# EAGLE design Adafruit 7in HDMI Backpack (EAGLE 6.6.0)
COMPANY: ADAFRUIT INDUSTRIES; DRAWN: FZHAO; REV: A
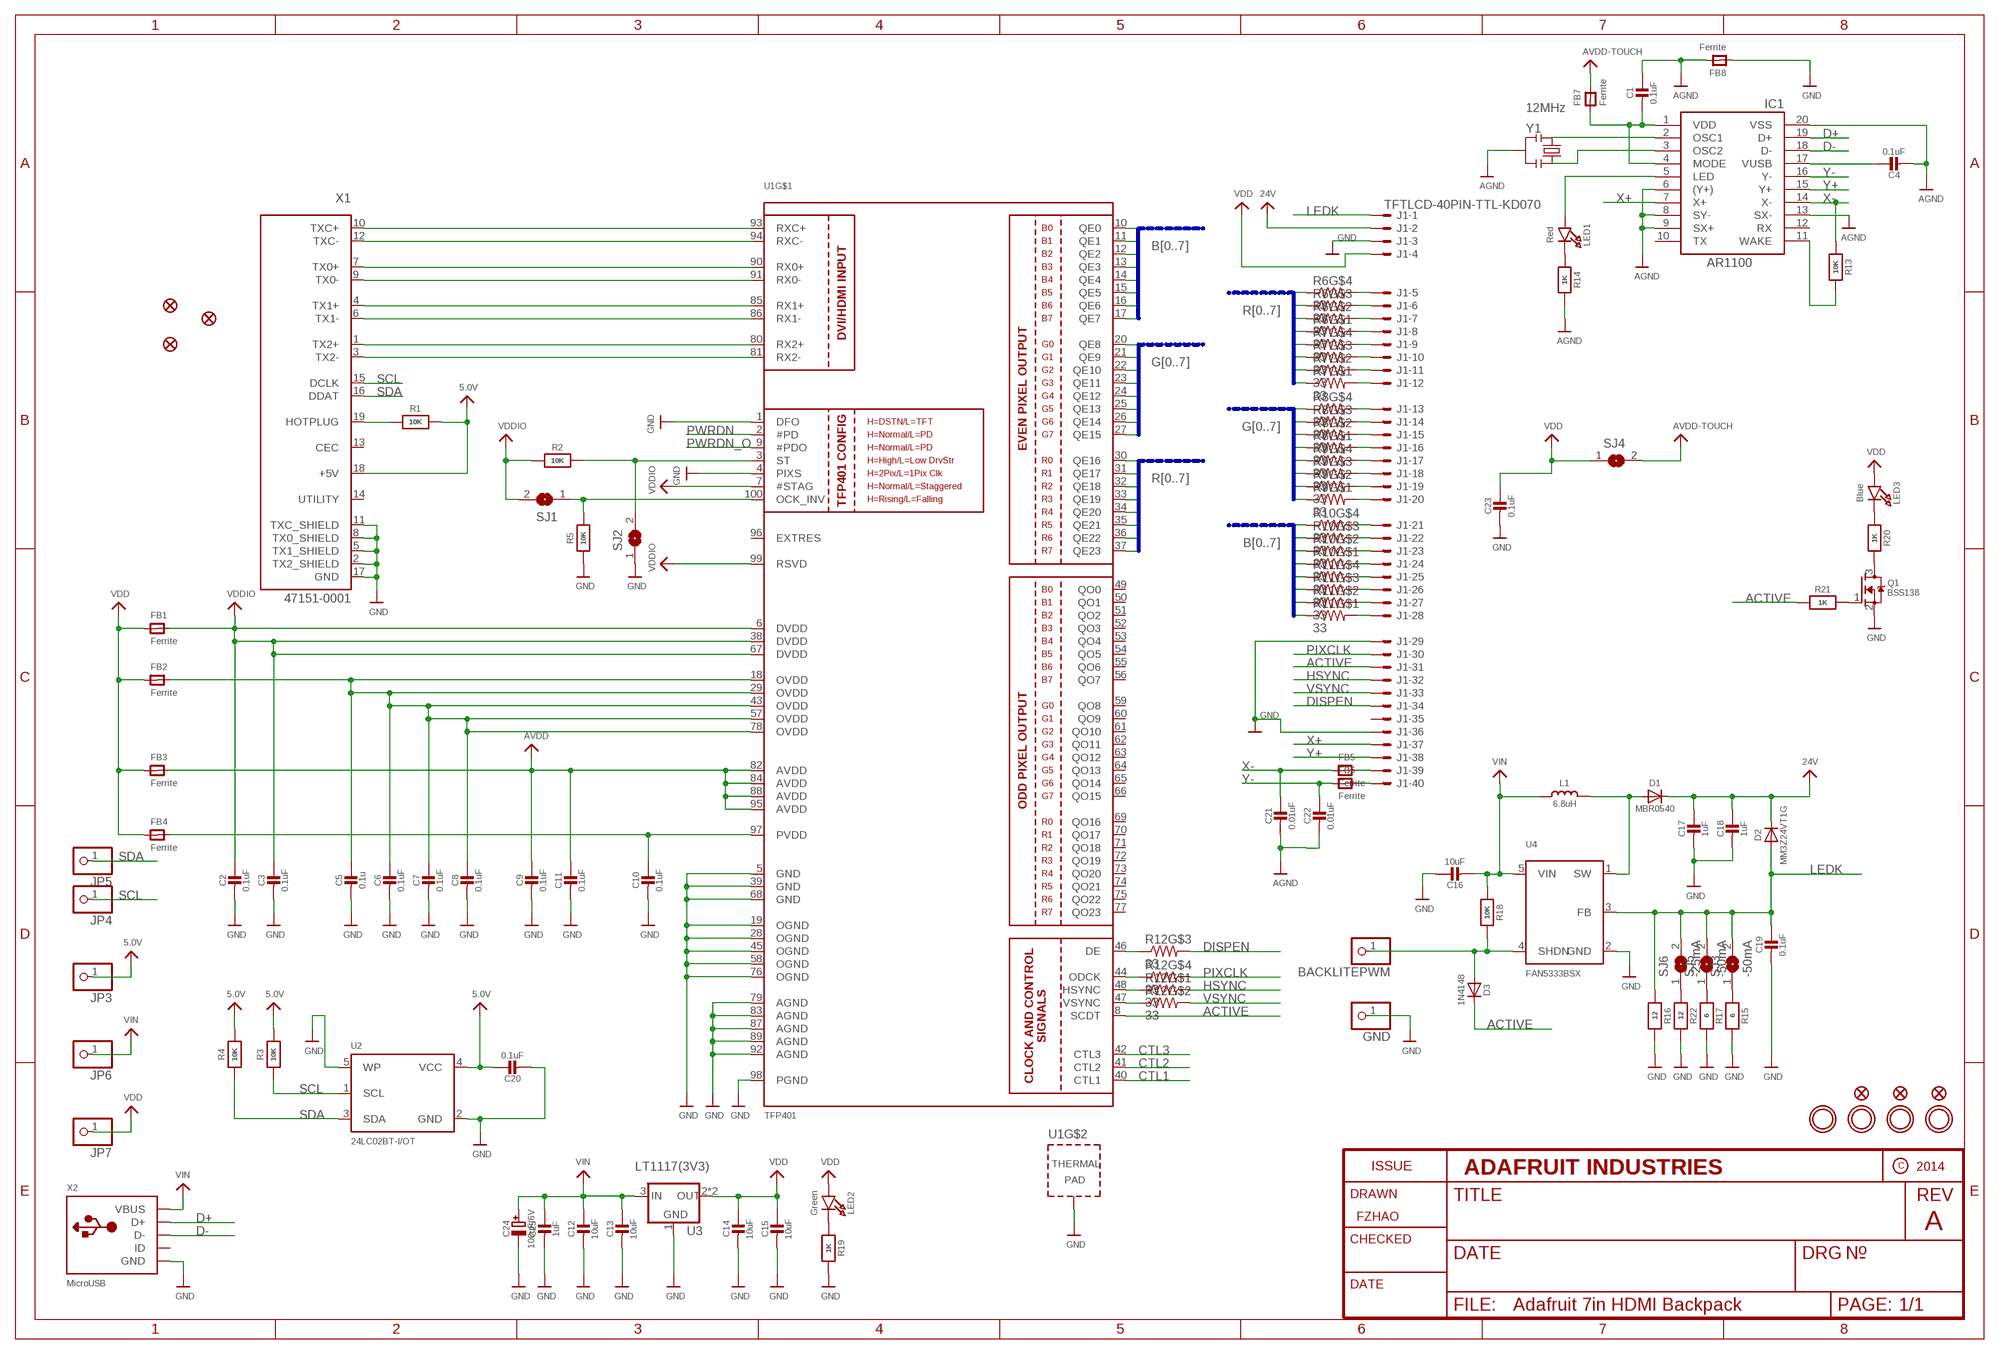
[diagram p0: schematic, sheet 1]

## Parts
BACKLITEPWM  HEADER-1X1-SMD_MASKHELD_2X2MM  [1X01_SMD_MASKHELD_2X2MM]
C1  0.1uF  CAP_CERAMIC0805-NOOUTLINE  [0805-NO]
C2  0.1uF  CAP_CERAMIC0805-NOOUTLINE  [0805-NO]
C3  0.1uF  CAP_CERAMIC0805-NOOUTLINE  [0805-NO]
C4  0.1uF  CAP_CERAMIC_0805MP  [_0805MP]
C5  0.1u  CAP_CERAMIC0805-NOOUTLINE  [0805-NO]
C6  0.1uF  CAP_CERAMIC_0805MP  [_0805MP]
C7  0.1uF  CAP_CERAMIC0805-NOOUTLINE  [0805-NO]
C8  0.1uF  CAP_CERAMIC0805-NOOUTLINE  [0805-NO]
C9  0.1uF  CAP_CERAMIC0805-NOOUTLINE  [0805-NO]
C10  0.1uF  CAP_CERAMIC0805-NOOUTLINE  [0805-NO]
C11  0.1uF  CAP_CERAMIC0805-NOOUTLINE  [0805-NO]
C12  10uF  CAP_CERAMIC0805-NOOUTLINE  [0805-NO]
C13  10uF  CAP_CERAMIC0805-NOOUTLINE  [0805-NO]
C14  10uF  CAP_CERAMIC0805-NOOUTLINE  [0805-NO]
C15  10uF  CAP_CERAMIC0805-NOOUTLINE  [0805-NO]
C16  10uF  CAP_CERAMIC0805-NOOUTLINE  [0805-NO]
C17  1uF  CAP_CERAMIC0805-NOOUTLINE  [0805-NO]
C18  1uF  CAP_CERAMIC0805-NOOUTLINE  [0805-NO]
C19  0.1uF  CAP_CERAMIC0805-NOOUTLINE  [0805-NO]
C20  0.1uF  CAP_CERAMIC0805-NOOUTLINE  [0805-NO]
C21  0.01uF  CAP_CERAMIC0805-NOOUTLINE  [0805-NO]
C22  0.01uF  CAP_CERAMIC0805-NOOUTLINE  [0805-NO]
C23  0.1uF  CAP_CERAMIC0805-NOOUTLINE  [0805-NO]
C24  100uF/6V  CAP_ELECTROLYTICPANASONIC_C  [PANASONIC_C]
C25  1uF  CAP_CERAMIC0805-NOOUTLINE  [0805-NO]
D1  MBR0540  DIODESOD-123  [SOD-123]
D2  MM3Z24VT1G  DIODESMA  [SMADIODE]
D3  1N4148  DIODESOD-323  [SOD-323]
FB1  Ferrite  FERRITE_0805MP  [_0805MP]
FB2  Ferrite  FERRITE_0805MP  [_0805MP]
FB3  Ferrite  FERRITE_0805MP  [_0805MP]
FB4  Ferrite  FERRITE_0805MP  [_0805MP]
FB5  Ferrite  FERRITE_0805MP  [_0805MP]
FB6  Ferrite  FERRITE_0805MP  [_0805MP]
FB7  Ferrite  FERRITE_0805MP  [_0805MP]
FB8  Ferrite  FERRITE_0805MP  [_0805MP]
FID1  FIDUCIAL""  [FIDUCIAL_1MM]
FID2  FIDUCIAL""  [FIDUCIAL_1MM]
FID3  FIDUCIAL""  [FIDUCIAL_1MM]
FID4  FIDUCIAL""  [FIDUCIAL_1MM]
FID5  FIDUCIAL""  [FIDUCIAL_1MM]
FID6  FIDUCIAL""  [FIDUCIAL_1MM]
GND  HEADER-1X1-SMD_MASKHELD_2X2MM  [1X01_SMD_MASKHELD_2X2MM]
IC1  AR1100  AR1100_SSOP  [TSSOP20-5.3MMBODY]
J1  TFTLCD-40PIN-TTL-KD070  [TFTLCD-KD070GD21-40NT]
JP3  HEADER-1X1-SMD_MASKHELD_2X2MM  [1X01_SMD_MASKHELD_2X2MM]
JP4  HEADER-1X1-SMD_MASKHELD_2X2MM  [1X01_SMD_MASKHELD_2X2MM]
JP5  HEADER-1X1-SMD_MASKHELD_2X2MM  [1X01_SMD_MASKHELD_2X2MM]
JP6  HEADER-1X1-SMD_MASKHELD_2X2MM  [1X01_SMD_MASKHELD_2X2MM]
JP7  HEADER-1X1-SMD_MASKHELD_2X2MM  [1X01_SMD_MASKHELD_2X2MM]
L1  6.8uH  INDUCTORNR5040  [INDUCTOR_5X5MM_NR5040_NOTHERMALS]
LED1  Red  LED0805_NOOUTLINE  [CHIPLED_0805_NOOUTLINE]
LED2  Green  LED0805_NOOUTLINE  [CHIPLED_0805_NOOUTLINE]
LED3  Blue  LED0805_NOOUTLINE  [CHIPLED_0805_NOOUTLINE]
Q1  BSS138  MOSFET-NWIDE  [SOT23-WIDE]
R1  10K  RESISTOR0805_NOOUTLINE  [0805-NO]
R2  10K  RESISTOR_0805MP  [_0805MP]
R3  10K  RESISTOR0805_NOOUTLINE  [0805-NO]
R4  10K  RESISTOR0805_NOOUTLINE  [0805-NO]
R5  10K  RESISTOR_0805MP  [_0805MP]
R6  33  RESISTOR_4PACK_US  [RESPACK_4X0603]
R7  33  RESISTOR_4PACK_US  [RESPACK_4X0603]
R8  33  RESISTOR_4PACK_US  [RESPACK_4X0603]
R9  33  RESISTOR_4PACK_US  [RESPACK_4X0603]
R10  33  RESISTOR_4PACK_US  [RESPACK_4X0603]
R11  33  RESISTOR_4PACK_US  [RESPACK_4X0603]
R12  33  RESISTOR_4PACK_US  [RESPACK_4X0603]
R13  10K  RESISTOR0805_NOOUTLINE  [0805-NO]
R14  1K  RESISTOR0805_NOOUTLINE  [0805-NO]
R15  6  RESISTOR0805_NOOUTLINE  [0805-NO]
R16  12  RESISTOR0805_NOOUTLINE  [0805-NO]
R17  6  RESISTOR0805_NOOUTLINE  [0805-NO]
R18  10K  RESISTOR0805_NOOUTLINE  [0805-NO]
R19  1K  RESISTOR0805_NOOUTLINE  [0805-NO]
R20  1K  RESISTOR0805_NOOUTLINE  [0805-NO]
R21  1K  RESISTOR0805_NOOUTLINE  [0805-NO]
R22  12  RESISTOR0805_NOOUTLINE  [0805-NO]
SJ1  SOLDERJUMPER  [SOLDERJUMPER_ARROW_NOPASTE]
SJ2  SOLDERJUMPER  [SOLDERJUMPER_ARROW_NOPASTE]
SJ3  -50mA  SOLDERJUMPERCLOSED  [SOLDERJUMPER_CLOSEDWIRE]
SJ4  SOLDERJUMPERCLOSED  [SOLDERJUMPER_CLOSEDWIRE]
SJ5  -50mA  SOLDERJUMPERCLOSED  [SOLDERJUMPER_CLOSEDWIRE]
SJ6  -25mA  SOLDERJUMPERCLOSED  [SOLDERJUMPER_CLOSEDWIRE]
U1  TFP401  [S-PQFP-G100]
U2  24LC02BT-I/OT  EEPROM_I2C_MCP24AA32  [SOT23-5]
U3  LT1117(3V3)  VREG_SOT223  [SOT223-R]
U4  FAN5333BSX  VREG_FAN5331  [SOT23-5]
U$31  MOUNTINGHOLE3.0  [MOUNTINGHOLE_3.0_PLATED]
U$32  MOUNTINGHOLE3.0  [MOUNTINGHOLE_3.0_PLATED]
U$33  MOUNTINGHOLE3.0  [MOUNTINGHOLE_3.0_PLATED]
U$34  MOUNTINGHOLE3.0  [MOUNTINGHOLE_3.0_PLATED]
X1  47151-0001  HDMI_MOLEX_47151DIM  [HDMI_MOLEX_47151-0001_DIMLAYER]
X2  MicroUSB  USBMICRO_20329  [4UCONN_20329]
Y1  12MHz  RESONATORSMD  [RESONATOR-SMD]

## Nets
5.0V: C20.1 JP3.1 R1.2 R3.2 R4.2 U2.4(VCC) X1.18(+5V)
24V: C17.1 C18.1 D1.C D2.C J1.2
ACTIVE: D3.C J1.31 R21.1 U1.8(SCDT)
AGND: C1.1 C4.2 C21.2 C22.2 FB8.2 IC1.6((Y+)) IC1.8(SY-) IC1.9(SX+) IC1.13(SX-) IC1.20(VSS) R14.2 Y1.2
ASD: R12.3 U1.46(DE)
AVDD: C9.1 C11.1 FB3.2 U1.82(AVDD) U1.84(AVDD) U1.88(AVDD) U1.95(AVDD)
AVDD2: FB7.2 SJ4.2 ; supply symbol labelled AVDD-TOUCH
B0: R10.4 U1.10(QE0)
B1: R10.3 U1.11(QE1)
B2: R10.2 U1.12(QE2)
B3: R10.1 U1.13(QE3)
B4: R11.4 U1.14(QE4)
B5: R11.3 U1.15(QE5)
B6: R11.2 U1.16(QE6)
B7: R11.1 U1.17(QE7)
CTL1: U1.40(CTL1)
CTL2: U1.41(CTL2)
CTL3: U1.42(CTL3)
CVB: R12.2 U1.47(VSYNC)
D+: IC1.19(D+) X2.D+
D-: IC1.18(D-) X2.D-
DISPEN: J1.34 R12.6
G0: R8.4 U1.20(QE8)
G1: R8.3 U1.21(QE9)
G2: R8.2 U1.22(QE10)
G3: R8.1 U1.23(QE11)
G4: R9.4 U1.24(QE12)
G5: R9.3 U1.25(QE13)
G6: R9.2 U1.26(QE14)
G7: R9.1 U1.27(QE15)
GND: C2.2 C3.2 C5.2 C6.2 C7.2 C8.2 C9.2 C10.2 C11.2 C12.2 C13.2 C14.2 C15.2 C16.1 C17.2 C18.2 C19.2 C20.2 C23.2 C24.- C25.2 FB8.1 GND.1 J1.3 J1.29 J1.36 Q1.2(S) R5.1 R15.2 R16.2 R17.2 R19.2 R22.2 SJ2.1 U1.1(DFO) U1.4(PIXS) U1.5(GND) U1.19(OGND) U1.28(OGND) U1.39(GND) U1.45(OGND) U1.58(OGND) U1.68(GND) U1.76(OGND) U1.79(AGND) U1.83(AGND) U1.87(AGND) U1.89(AGND) U1.92(AGND) U1.98(PGND) U1.P$1(TP) U1.P$2(TP) U1.P$3(TP) U1.P$4(TP) U1.P$5(TP) U1.P$6(TP) U1.P$7(TP) U1.P$8(TP) U1.P$9(TP) U1.P$10(TP) U1.P$11(TP) U1.P$12(TP) U1.P$13(TP) U1.P$14(TP) U1.P$15(TP) U1.P$16(TP) U1.THERMAL(TP) U2.2(GND) U2.5(WP) U3.1(GND) U4.2(GND) X1.2(TX2_SHIELD) X1.5(TX1_SHIELD) X1.8(TX0_SHIELD) X1.11(TXC_SHIELD) X1.17(GND) X2.BASE@1(GND) X2.BASE@2(GND) X2.GND X2.SPRT@1(GND) X2.SPRT@2(GND) X2.SPRT@3(GND) X2.SPRT@4(GND)
HSYNC: J1.32 R12.8
LEDK: C19.1 D2.A J1.1 R16.1 SJ3.2 SJ5.2 SJ6.2 U4.3(FB)
N$1: U1.93(RXC+) X1.10(TXC+)
N$2: U1.94(RXC-) X1.12(TXC-)
N$3: U1.90(RX0+) X1.7(TX0+)
N$4: U1.91(RX0-) X1.9(TX0-)
N$5: U1.85(RX1+) X1.4(TX1+)
N$6: U1.86(RX1-) X1.6(TX1-)
N$7: U1.80(RX2+) X1.1(TX2+)
N$8: U1.81(RX2-) X1.3(TX2-)
N$9: R1.1 X1.19(HOTPLUG)
N$10: IC1.2(OSC1) Y1.1
N$11: IC1.3(OSC2) Y1.3
N$12: C4.1 IC1.17(VUSB)
N$13: LED2.C R19.1
N$14: J1.5 R6.5
N$15: J1.6 R6.6
N$16: J1.7 R6.7
N$17: J1.8 R6.8
N$18: J1.9 R7.5
N$19: J1.10 R7.6
N$20: J1.11 R7.7
N$21: J1.12 R7.8
N$22: J1.13 R8.5
N$23: J1.14 R8.6
N$24: J1.15 R8.7
N$25: J1.16 R8.8
N$26: J1.17 R9.5
N$27: J1.18 R9.6
N$28: J1.19 R9.7
N$29: J1.20 R9.8
N$30: J1.21 R10.5
N$31: J1.22 R10.6
N$32: J1.23 R10.7
N$33: J1.24 R10.8
N$34: J1.25 R11.5
N$35: J1.26 R11.6
N$36: J1.27 R11.7
N$37: R17.1 SJ5.1
N$38: C10.1 FB4.2 U1.97(PVDD)
N$39: J1.28 R11.8
N$40: IC1.11(WAKE) R13.2
N$41: LED1.C R14.1
N$42: C5.1 C6.1 C7.1 C8.1 FB2.2 U1.18(OVDD) U1.29(OVDD) U1.43(OVDD) U1.57(OVDD) U1.78(OVDD)
N$43: IC1.5(LED) LED1.A
N$44: R22.1 SJ6.1
N$45: LED3.C R20.1
N$46: Q1.3(D) R20.2
N$47: D1.A L1.P$2 U4.1(SW)
N$48: Q1.1(G) R21.2
N$49: R15.1 SJ3.1
N$52: BACKLITEPWM.1 D3.A R18.2 U4.4(SHDN)
N$53: FB5.2 J1.39
N$54: FB6.2 J1.40
N$55: C1.2 FB7.1 IC1.1(VDD) IC1.4(MODE)
OCK_INV: R5.2 SJ1.1 U1.100(OCK_INV)
PIXCLK: J1.30 R12.5
PWRDN: U1.2(#PD)
PWRDN_O: U1.9(#PDO)
R0: R6.4 U1.30(QE16)
R1: R6.3 U1.31(QE17)
R2: R6.2 U1.32(QE18)
R3: R6.1 U1.33(QE19)
R4: R7.4 U1.34(QE20)
R5: R7.3 U1.35(QE21)
R6: R7.2 U1.36(QE22)
R7: R7.1 U1.37(QE23)
SCL: JP4.1 R3.1 U2.1(SCL) X1.15(DCLK)
SDA: JP5.1 R4.1 U2.3(SDA) X1.16(DDAT)
ST: R2.2 SJ2.2 U1.3(ST)
VDD: C14.1 C15.1 C23.1 FB1.1 FB2.1 FB3.1 FB4.1 J1.4 JP7.1 LED2.A LED3.A SJ4.1 U3.2(OUT) U3.4(OUT)
VDDIO: C2.1 C3.1 FB1.2 R2.1 SJ1.2 U1.6(DVDD) U1.7(#STAG) U1.38(DVDD) U1.67(DVDD) U1.99(RSVD)
VIN: C12.1 C13.1 C16.2 C24.+ C25.1 JP6.1 L1.P$1 R18.1 U3.3(IN) U4.5(VIN) X2.VBUS
VSYNC: J1.33 R12.7
X+: IC1.7(X+) J1.37
X-: C21.1 FB5.1 IC1.14(X-) R13.1
XCV: R12.1 U1.48(HSYNC)
Y+: IC1.15(Y+) J1.38
Y-: C22.1 FB6.1 IC1.16(Y-)
ZXC: R12.4 U1.44(ODCK)
Unconnected: IC1.10(TX) IC1.12(RX) J1.35 U1.49(QO0) U1.50(QO1) U1.51(QO2) U1.52(QO3) U1.53(QO4) U1.54(QO5) U1.55(QO6) U1.56(QO7) U1.59(QO8) U1.60(QO9) U1.61(QO10) U1.62(QO11) U1.63(QO12) U1.64(QO13) U1.65(QO14) U1.66(QO15) U1.69(QO16) U1.70(QO17) U1.71(QO18) U1.72(QO19) U1.73(QO20) U1.74(QO21) U1.75(QO22) U1.77(QO23) U1.96(EXTRES) X1.13(CEC) X1.14(UTILITY) X2.ID

## Buses
B[0..7]
G[0..7]
R[0..7]

## Power pins joined to a net without a drawn wire
GND: X1.P$1(GND) X1.P$2(GND) X1.P$3(GND) X1.P$4(GND)

## Library data of the parts
BACKLITEPWM GND JP3-JP7 = microbuilder:HEADER-1X1: PIN HEADER
C1-C23 C25 = microbuilder:CAP_CERAMIC: Ceramic Capacitors For new designs, use the packages preceded by an '_' character since they are more reliable: The following footprints should be used on most boards: _0402 - Standard footprint for regular board layouts _0603 - Standard footprint for regular board layouts _0805 - Standard footprint for regular board layouts _1206 - Standard footprint for regular board layouts For extremely tight-pitch boards where space is at a premium, the following 'micro-pitch' footprints can be used (smaller pads, no silkscreen outline, etc.): _0402MP - Micro-pitch footprint for very dense/compact boards _0603MP - Micro-pitch footprint for very dense/compact boards _0805MP - Micro-pitch footprint for very dense/compact boards _1206MP - Micro-pitch footprint for very dense/compact boards
C24 = microbuilder:CAP_ELECTROLYTIC: Electrolytic Capacitors SMT PANASONIC_C - Size C Panasonic Electrolytic Aluminum Capacitor 47µF 16V 20% Electrolytic Capacitor [Digikey: PCE3890TR-ND] PANASONIC_D - Size D Panasonic Electrolytic Aluminum Capacitor 100µF 25V 20% Electrolytic Capacitor [Digikey: PCE3898TR-ND] PTH 3.5 mm grid, 8 mm diameter ... 3.5 mm grid, 10 mm diameter ...
D1-D3 = microbuilder:DIODE: Diode SMA Model Volts Amps Type Vf Ir Digikey # Notes SSA34-E3 40V 3A Schottky 480mV @ 3A 200uA @ 40V SSA34-E3/61TGITR-ND CDBA120-G 20V 1A Schottky 500mV @ 1A 500uA @ 20V 641-1014-6-ND REEL MBRA210 10V 2A Schottky 350mV @ 2A 700uA @ 10V MBRA210LT3 SOD-123 Model Volts Amps Type Vf Ir Order # Notes BAT54T1G 30V 200mA Schottky 800mV @ 200mA 2uA @ 25V BAT54T1GOSTR-ND B0530W 30V 500mA Schottky 430mV @ 500mA 130uA @ 30V B0530W-FDICT-ND REEL MBR120 20V 1A Schottky 340mV @ 1A MBR120VLSFT1GOSCT-ND SOD-323 Model Volts Amps Type Vf Ir Order # Notes PMEG2005EJ 20V 500mA Schottky 355mV @ 500mA 568-4110-1-ND ZLLS410 10V 570mA Schottky 380mV @ 570mA ZLLS410CT-ND 1N4148WS 75V 150mA Silicon/Simple 1V 1N4148WSFSCT-ND REEL SOD-523 Model Volts Amps Type Vf Ir Order # Notes BAT54XV2 30V 200mA Schottky 0.8V @ 100mA BAT54XV2CT-ND TB751S 30V 30mA Schottky RB751S-40TE61CT-ND SOT23-R/W (R = Solder Paste/Reflow Ovens, W = Hand-Soldering) Model Volts Amps Type Vf Ir Order # Notes BAT54FILM 40V 300mA Schottky 497-7162-1-ND POWERDI-5 Model Volts Amps Type Vf Ir Order # Notes PDS560 60V 5A Schottky 670mV @ 5A 150uA @ 60V PDS560DICT-ND
FB1-FB8 = microbuilder:FERRITE: Ferrite Bead 0603 MMZ1608B121C - 120 Ohm @ 100MHz, 600mA, 0.15 Ohm DC Resistance - Digikey: 445-2164-1-ND BK1608HW121-T - 120 Ohm, 600mA Ferrite Chip - Digikey: 587-1876-2-ND 0805 HZ0805B272R-10 - 2.7K Ohm @ 100MHz, 200mA, 0.8 Ohm DC Resistance - Digikey: 240-2504-1-ND (see also Murata BLM21BD272SN1L) MMZ2012Y152B - 1.5K Ohm @ 100MHz, 500mA, 0.4 Ohm DC Resistance - Digikey: 445-1560-1-ND - Mainly for high frequency (80-400MHz) MMZ2012R102A - 1K Ohm @ 100MHz, 500mA, 0.3 Ohm DC Resistance - Digikey: 445-1555-2-ND - More general purpose (10-200MHz)
FID1-FID6 = microbuilder:FIDUCIAL: Fiducial Alignment Points Various fiducial points for machine vision alignment.; BOM: EXCLUDE
IC1 = microbuilder:AR1100
J1 = microbuilder:TFTLCD-40PIN-TTL: OMRON FPC Connector Source : http://www.omron.com/ecb/products/pdf/fpc.pdf Good for connecting up 'PSP' SHARP LQ043 LCDs
L1 = microbuilder:INDUCTOR: Inductors 0603: 10nH Ceramic Inductor - microwire antenna/RF (Digikey: 712-1434-2-ND) 0805: 560nH Ceramic Inductor - RF (Digikey: 553-1047-1-ND) 270nH Ceramic Inductor - Q = 40@250MHz, +-5%, 1 Ohm DC Resistance (Digikey: 535-10506-2-ND) 1007 (2518 Metric) SMT: 10µH 10% 250mOhm 820mA 1007 Inductor (Digikey: 587-2189-1-ND) 22µH 10% 500mOhm 580mA 1007 Inductor (Digikey: 587-2190-1-ND) 47µH 10% 950mOhm 420mA 1007 Inductor (Digikey: 587-2191-1-ND) 47µH 5% 100mOhm 1A 1008 Inductor (Digikey: 732-1816-1-ND) 5.0x5.0mm (Taiyo Yuden NR5040 Series) 6.8µH 20% 2.3A 64mOhm Inductor (Digikey: 587-2374-2-ND) 5.0x5.0mm (TDK VLC5045 Series) 4.7µH 20% 3.3A 34mOhm Inductor (Digikey: 445-6526-1-ND) 6.8µH 20% 2.7A 46mOhm Inductor (Digikey: 445-6527-1-ND) 6.0x6.0mm (TDK VLC6045 Series) 4.7µH 20% 3.8A 27mOhm Inductor (Digikey: 445-6538-2-ND) 6.8µH 20% 3A 41mOhm Inductor (Digikey: 445-6540-1-ND) 6.2µH 30% 2.2A 45mOhm Inductor (Digikey: SRR5028-6R2YCT-ND) - Not TDK VLC6045 but footprint should match 6.0x6.0mm (TDK SLF6045 Series) 6.8uH 30% 2A 33mOhm Inductor (Digikey: 445-4572-1-ND, Mouser: 810-SLF645T6R8N2R0PF) 6.0x6.0mm (Sumida CDRH5D28 Series) 6.2uH 30% 1.8A 45mOhm Inductor (Digikey: 308-1542-1-ND) Taiyo Yuden NR3015T2R2M - 2.2uH 20% 1.5A (Digikey: 587-1648-2-ND, Mouser: 963-NR3015T2R2M) - Used with TI TPS62172 CoilCraft RFID Transponder Coil - MA5532-AE (For use with AS3935 Lightning Sensor) Vishay IHLP 1.0uH Molded Inductor - 24mOhm DCR, 5A, +/-20%, -55°C-125°C (Digikey: 541-1319-1-ND)
LED1-LED3 = microbuilder:LED: LED 0603 - 0603 Surface Mount Package 2mA: Green LED - Low Power (3.9mcd, 2ma, 1.7Vf) - Digikey: 475-2709-2-ND Orange LED - Low Power (9.8mcd, 2ma, 1.8Vf) - Digikey: 475-1194-2-ND Red LED - Low Power (5mcd, 2ma, 1.8Vf) - Digikey: 475-1195-2-ND Yellow LED - Low Power (7mcd, 2ma, 1.8Vf) - Digikey: 475-1196-2-ND 5mA: Blue LED - Low Power (17mcd, 5ma, 2.9Vf) - Digikey: LNJ937W8CRACT-ND 0805 - 0805 Surface Mount Package 2mA: Red LED (8.8mcd, 2mA, 1.8Vf, Clear) - Low Power [Digikey: 475-2510-1-ND] Green LED (5mcd, 2mA, 1.8Vf, Clear) - Low Power [Digikey: 475-2730-1-ND] Yellow LED (11.3mcd, 2mA, 1.8Vf, Clear) - Low Power [Digikey: 475-2555-1-ND] 20mA: Red LED (104mcd, 20mA, Diffused) - LS R976 [Digikey: 475-1278-6-ND] Red LED (12mcd, 20mA, 2.0Vf, Clear) - APT2012EC [Digikey: 754-1128-1-ND] Green LED (15mcd, 20mA, 2.2Vf, Clear) - APT2012GC [Digikey: 754-1131-1-ND] Orange LED (160mcd, 20mA, 2.1Vf, Clear) - APT2012SECK [Digikey: 754-1130-1-ND] 1206 - 1206 Surface Mount Package Green LED (26mcd, 20mA, Diffused) - LG N971 [Digikey: 475-1407-6-ND] Red LED (15mcd, 20mA, Diffused) - LH N974 [Digikey: 475-1416-6-ND] Cree - Cree High-Power Surface Mount LEDs XPEBWT-L1-0000-00D50 - White 111lm 350mA 2.9Vf 6200K 110° XTEAWT-00-0000-00000LEE3 - White 114lm 350mA 2.85Vf 5000K 115° Everlight - Everlight 45-21 Series Surface Mount LEDs 45-21/QK2C-B2832AC2CB2/2T - Warm White 2000mcd 20mA 3.25Vf 3050K 120° 45-21/LK2C-B38452C4CB2/2T - Nuetral White 2000mcd 20mA 3.25Vf 4150K 120° 45-21/LK2C-B50634C6CB2/2T - Cold White 2200mcd 20mA 3.25Vf 5650K 120° PLCC2 Reverse Mount LS T77K-J1L2-1-0-2-R18-Z - Red 11.25mcd 2mA 1.8Vf 630nm 120° LO T77K-L1M2-24-Z - Orange 19.6mcd 2mA 1.8Vf 606nm 120° LY T77K-K2M1-26-Z - Yellow 15.7mcd 2mA 1.8Vf 587nm 120°
Q1 = microbuilder:MOSFET-N: N-Channel Mosfet LEGEND VDS: Voltage Drain-Source ID: Drain Current RDS(ON): Drain-Source On-State Resistance VGS(TH): Gate-Source Threshold Voltage CISS: Drain-Source Input Capacitance SOT-23 Name VDS ID RDS(ON) VGS(TH) CISS Order Number 2N7002E 60V 260mA 2.5 Ohm 2.5V @ 250uA 26.7pF @ 25V 2N7002ET1GOSTR-ND BSH103 30V 850mA 400 mOhm 400mV @ 1mA 83pF @ 24V BSH103,235-ND BSS138 60V 320mA 1.6 Ohm 1.5V @ 250uA 50pF @ 10V Mouser: 771-BSS138PW115 DMN2075U-7 20V 4.2A 38 mOhm 1V @ 250 uA 594.3pF @ 10V DMN2075U-7DICT-ND * BSS138 good choice for I2C level-shifting POWERPAK 1212-8 Name VDS ID RDS(ON) VGS(TH) CISS Order Number Si7308DN 60V 6A 58 mOhm 3V @ 250uA 665pF @ 15V SI7308DN-T1-E3CT-ND
R1-R5 R13-R22 = microbuilder:RESISTOR: Resistors For new designs, use the packages preceded by an '_' character since they are more reliable: The following footprints should be used on most boards: _0402 - Standard footprint for regular board layouts _0603 - Standard footprint for regular board layouts _0805 - Standard footprint for regular board layouts _1206 - Standard footprint for regular board layouts For extremely tight-pitch boards where space is at a premium, the following 'micro-pitch' footprints can be used (smaller pads, no silkscreen outline, etc.): _0402MP - Micro-pitch footprint for very dense/compact boards _0603MP - Micro-pitch footprint for very dense/compact boards _0805MP - Micro-pitch footprint for very dense/compact boards _1206MP - Micro-pitch footprint for very dense/compact boards
R6-R12 = microbuilder:RESISTOR_4PACK_US: Resistor Packs (4 resistors) 4 x 0603 10K 1/16W - Digikey: YC164J-10KCT-ND
SJ1 SJ2 = microbuilder:SOLDERJUMPER: SMD Solder JUMPER Solder the two pads together to create a connection, or remove the solder to break it. REFLOW - Use this footprint for solder paste and reflow ovens. WAVE - Use this footprint for hand-soldering (larger pads). CLOSED - Has a trace between the two pads to ensure it is closed by default. The trace needs to be cut to disable the jumper, and can be closed again by creating a solder bridge between the two pads.; BOM: EXCLUDE
SJ3-SJ6 = microbuilder:SOLDERJUMPER: SMD Solder JUMPER Solder the two pads together to create a connection, or remove the solder to break it. REFLOW - Use this footprint for solder paste and reflow ovens. WAVE - Use this footprint for hand-soldering (larger pads). CLOSED - Has a trace between the two pads to ensure it is closed by default. The trace needs to be cut to disable the jumper, and can be closed again by creating a solder bridge between the two pads.
U1 = microbuilder:TFP401: TFP401 PanelBus Digital Receiver Supports Pixel Rates Up to 165 MHz (Including 1080p and WUXGA at 60Hz) Supply Voltage: 3.0-3.6V Operating Temperature: 0-70°C (EP version exists with -55-125°C)
U2 = microbuilder:EEPROM_I2C_MCP24AA32: Microchip 32K (4K x 8) 1.8V I2C EEPROM SOT23-5 [Digikey: 24AA32AFT-I/OTCT-ND]
U3 = microbuilder:VREG_SOT223: SOT-223 Fixed Voltage Regulators Part Current Out V Out V In V Dropout θJA (°C/W) TJ (°C) Operating Temp Digikey Part No. AP1117 1A 3.3V 18V 1.1V@500mA, 1.3V@1A 107°C/W 150°C -40°C-125°C AP1117IE33G-13DICT-ND Max operating temp can be calculated using θJA, TJ (max junction temperature), and power in watts. Set the "Maximum Ambient Temperature" until it reaches TJ ("Max Junction Temperature"), which is the absolute limit for safe use of the regulator: Heat Sink Temperature Calculator <http://www.daycounter.com/Calculators/Heat-Sink-Temperature-Calculator.phtml> For example, With 12V source into a 3.3V LP2985 and a 30mA load, we are dissipating (12V-3.3V) * 0.03A = 0.261W. With a θJA of 206 °C/W, a TJ of 150°C, and 261mW we can safely use the chip without a heat sink up to 75°C (=147.1°C Junction Temperature).
U4 = microbuilder:VREG_FAN5331: FAN5331 - LED/OLED 20V Boost Converter Digikey: FAN5331SXCT-ND
U$31-U$34 = microbuilder:MOUNTINGHOLE: Mounting Hole For #2 screws (0.086"/2.18mm width, 0.094"/2.4mm hole) use 2.5mm; BOM: EXCLUDE
X1 = microbuilder:HDMI_MOLEX_47151: The default footprint uses layer 46 (Milling) for the tabs, the DIMLAYER footprint uses layer 20 (Dimensions). Both will probably require special instructions to the board house
X2 = microbuilder:USB: USB Connectors USBMINIB - Surface Mount Female Mini-B USB Connector 4UConnector: 06564
Y1 = SparkFun:RESONATOR: Resonator Small SMD resonator. This is the itty bitty 10/20MHz resonators with built in caps. CSTCE10M0G55 and CSTCE20M0V53. Footprint has been reviewed closely but hasn't been tested yet.

## Board
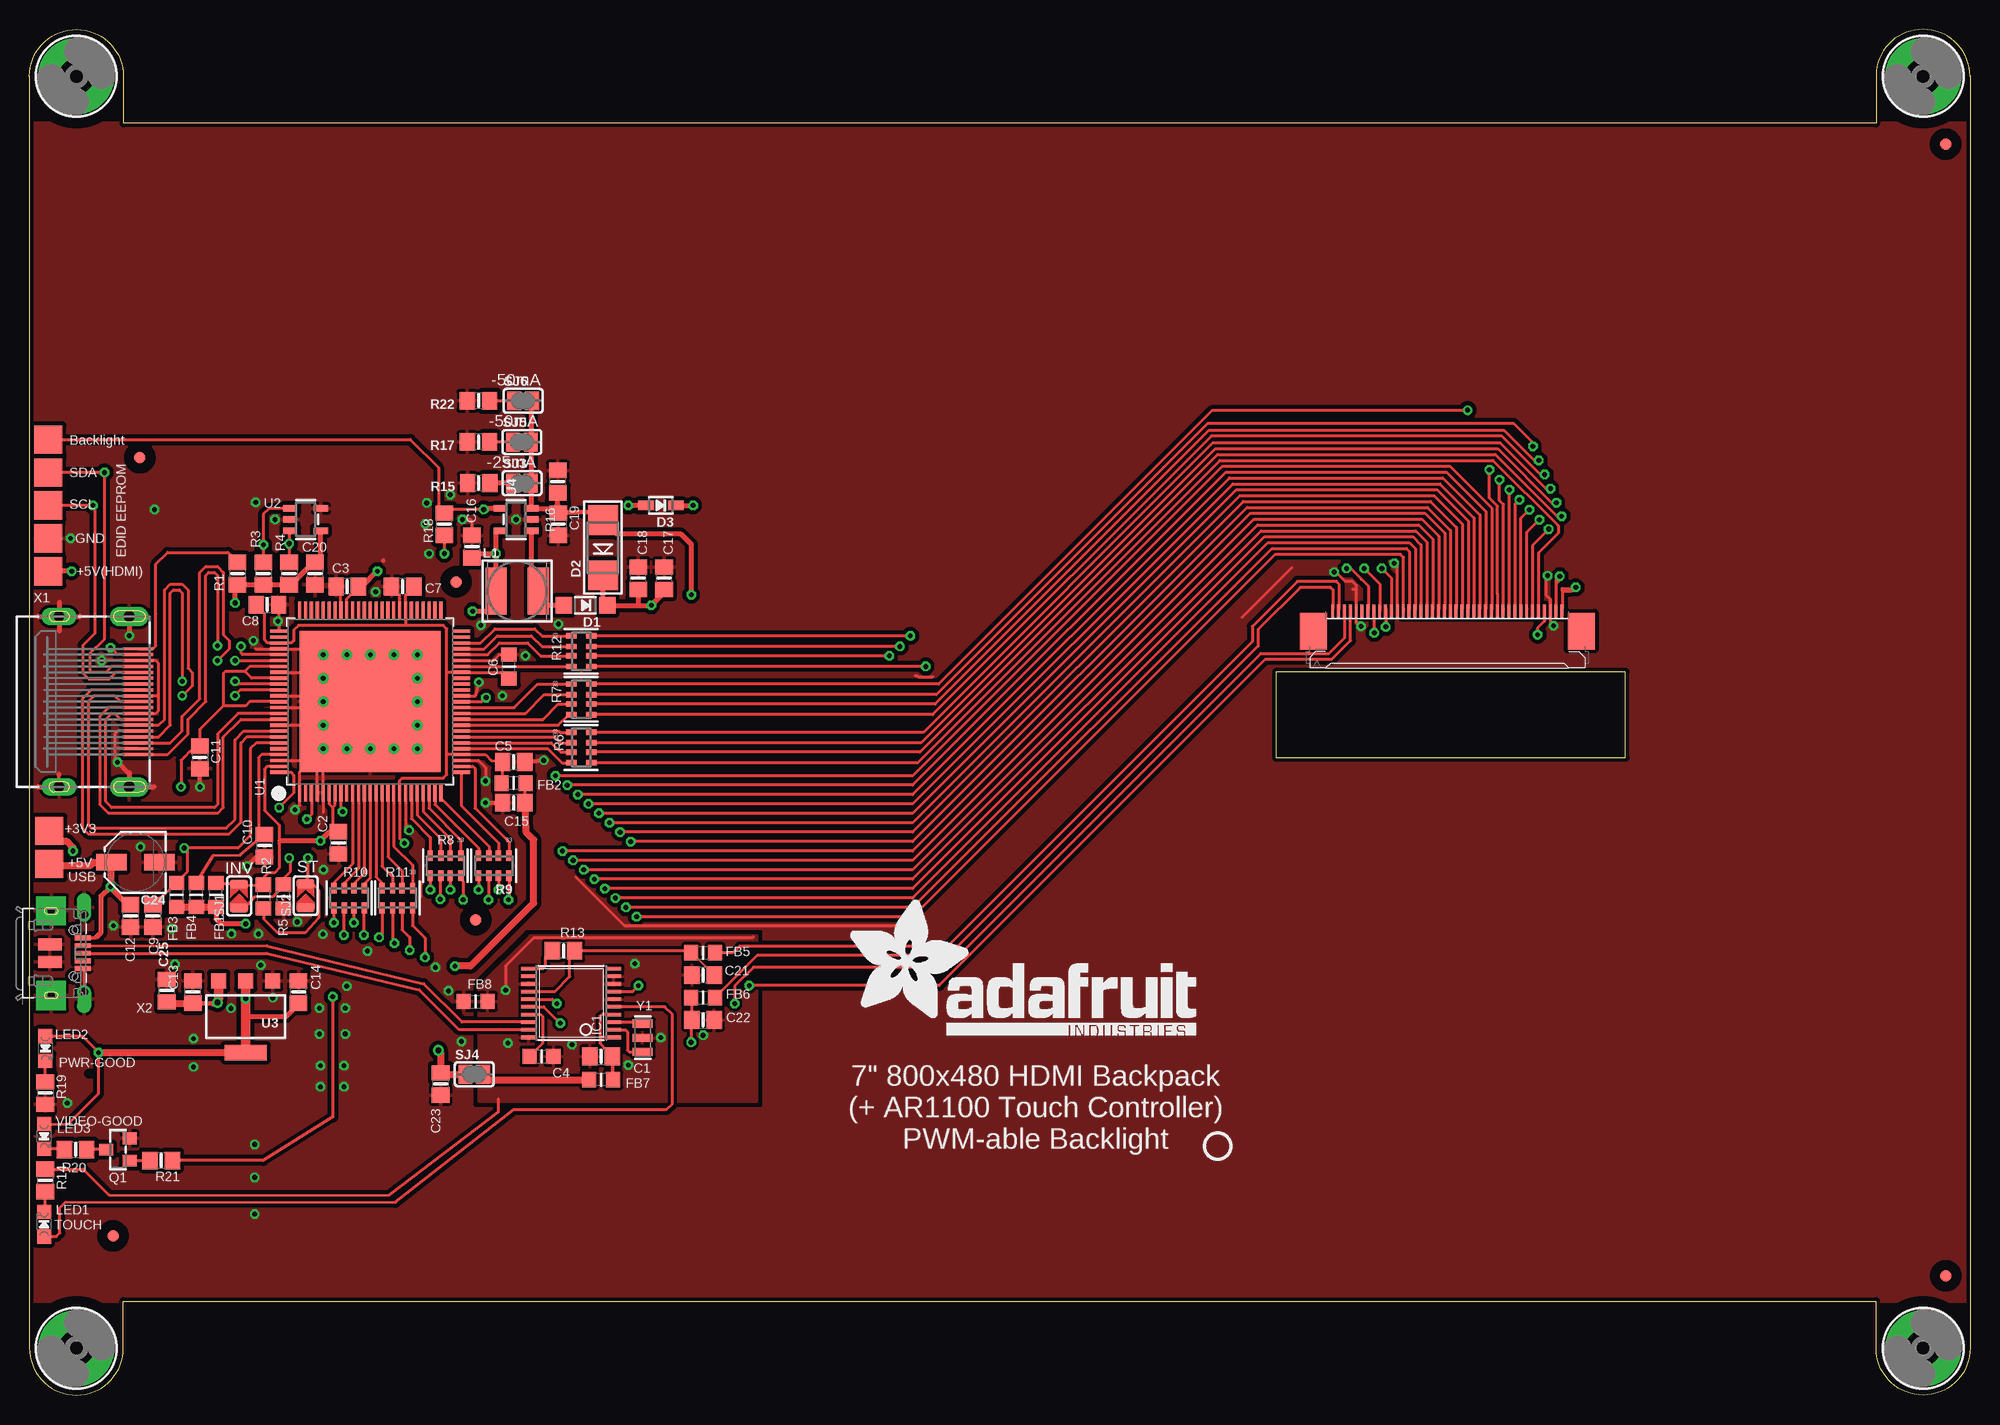
[diagram p1: board, top side]
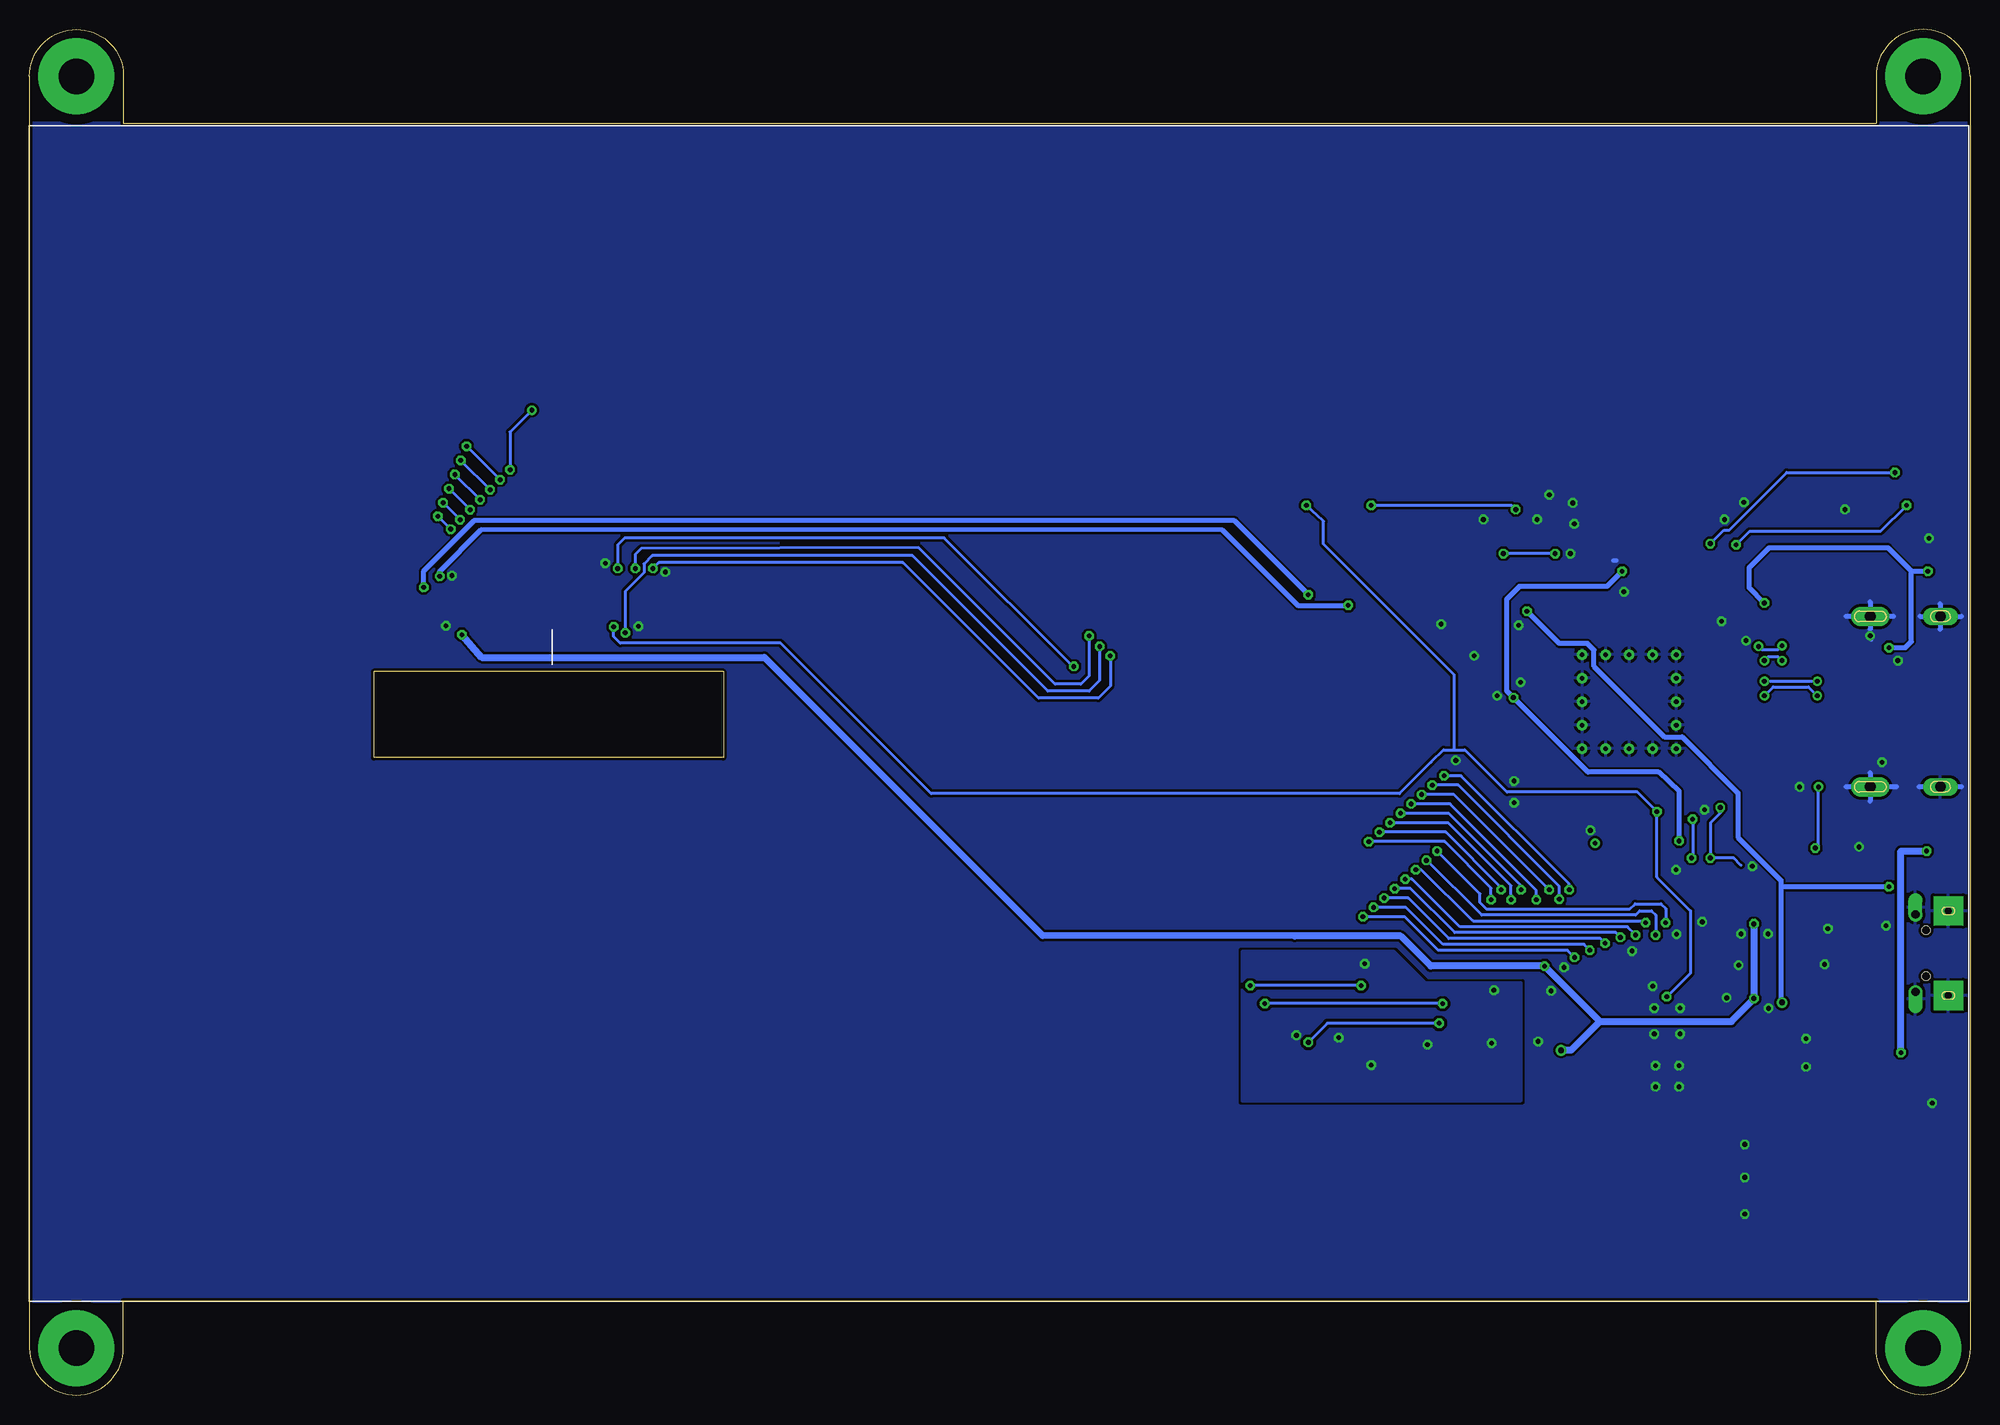
[diagram p2: board, bottom side, seen from below]

Size 165.1 x 116.2 mm. Coordinates in mm from the lower left corner, seen from the top.
Outline: 0,112.2 0,4 arc90 4,0 arc90 8,4 8,8 157.1,8 157.1,4 arc90 161.1,0 arc90 165.1,4 165.1,112.2 arc90 161.1,116.2 arc90 157.1,112.3 157.1,108.2 8,108.2 8,112.2 arc90 4,116.2 arc90 0,112.2
Outline: 106.05,61.55 135.77,61.55 135.77,54.24 106.05,54.24 106.05,61.55
Copper layers (1*16): Top 0.035mm / dielectric 1.5mm / Bottom 0.035mm
Design rules "adafruit *": minimum track width 8mil, minimum drill 15.5mil, track to track 8mil, track to pad 8mil, pad to pad 8mil, via to via 8mil, smd to smd 8mil, copper to edge 10mil, drill to drill 8mil, minimum pad ring 10mil, minimum via ring 8mil, stop-mask expansion 2mil, vias tented up to drill 20mil, thermal gap 10mil
tRestrict: area -19.7,43.1 to -19.6,43.4; area -22.1,53.9 to -21.6,55; area -22.1,51.9 to -21.6,53.1; area -22.1,50.8 to -21.6,51.1; area -22.1,49.2 to -21.6,50.2; area -22.1,46.2 to -21.7,48.6; area -22.1,45.4 to -21.8,45.6; area -21.2,44.1 to -20.2,44.8; area -19.1,44.2 to -13.2,44.8; area 5,27.3 to 5.6,27.4

### Footprints (pad centres in the part's own frame; a part is rotated, then mirrored left to right if it is on the bottom)
1X01_SMD_MASKHELD_2X2MM = smd 2.4 x 2.4: 1 0,0
0805-NO = smd 1.3 x 1.5: 1 -0.95,0; 2 0.95,0
_0805MP = smd 1.2 x 1.3: 1 -1.016,0; 2 1.016,0
PANASONIC_C = smd 2.6 x 1.4: + 2.05,0; - -2.05,0
SOD-123 = smd 1.4 x 1.4: A 1.85,0; C -1.85,0
SMADIODE = smd 2.54 x 2.54: A 2.349,0; C -2.349,0
SOD-323 = smd 1.35 x 0.8: A 1.27,0; C -1.27,0
FIDUCIAL_1MM = smd 1 x 1: 1 0,0
TSSOP20-5.3MMBODY = smd 0.305 x 1.27: 1 -2.925,-3.618; 2 -2.275,-3.618; 3 -1.625,-3.618; 4 -0.975,-3.618; 5 -0.325,-3.618; 6 0.325,-3.618; 7 0.975,-3.618; 8 1.625,-3.618; 9 2.275,-3.618; 10 2.925,-3.618; 11 2.925,3.618; 12 2.275,3.618; 13 1.625,3.618; 14 0.975,3.618; 15 0.325,3.618; 16 -0.325,3.618; 17 -0.975,3.618; 18 -1.625,3.618; 19 -2.275,3.618; 20 -2.925,3.618
TFTLCD-KD070GD21-40NT = smd 0.25 x 1.1 bottom: 1 34.73,58.7; 2 35.23,58.7; 3 35.73,58.7; 4 36.23,58.7; 5 36.73,58.7; 6 37.23,58.7; 7 37.73,58.7; 8 38.23,58.7; 9 38.73,58.7; 10 39.23,58.7; 11 39.73,58.7; 12 40.23,58.7; 13 40.73,58.7; 14 41.23,58.7; 15 41.73,58.7; 16 42.23,58.7; 17 42.73,58.7; 18 43.23,58.7; 19 43.73,58.7; 20 44.23,58.7; 21 44.73,58.7; 22 45.23,58.7; 23 45.73,58.7; 24 46.23,58.7; 25 46.73,58.7; 26 47.23,58.7; 27 47.73,58.7; 28 48.23,58.7; 29 48.73,58.7; 30 49.23,58.7; 31 49.73,58.7; 32 50.23,58.7; 33 50.73,58.7; 34 51.23,58.7; 35 51.73,58.7; 36 52.23,58.7; 37 52.73,58.7; 38 53.23,58.7; 39 53.73,58.7; 40 54.23,58.7 | smd 2.3 x 3.1 bottom: M1 55.88,57; M2 33.08,57
INDUCTOR_5X5MM_NR5040_NOTHERMALS = smd 1.8 x 4: P$1 -1.8,0; P$2 1.8,0
CHIPLED_0805_NOOUTLINE = smd 1.2 x 1.2: A 0,-1.05; C 0,1.05
SOT23-WIDE = smd 1 x 1.2: 1 -0.95,-1; 2 0.95,-1; 3 0,1
RESPACK_4X0603 = smd 0.45 x 0.9: 1 -1.3,-0.85; 2 -0.4,-0.85; 3 0.4,-0.85; 4 1.3,-0.85; 5 1.3,0.85; 6 0.4,0.85; 7 -0.4,0.85; 8 -1.3,0.85
SOLDERJUMPER_ARROW_NOPASTE = smd 0.762 x 1.524: 1 -1.016,0; 2 1.016,0
SOLDERJUMPER_CLOSEDWIRE = smd 1.168 x 1.6: 1 -0.762,0; 2 0.762,0 | smd 0.635 x 0.203: WIRE 0,0
S-PQFP-G100 = smd 0.27 x 1.5: 1 -6,-7.75; 2 -5.5,-7.75; 3 -5,-7.75; 4 -4.5,-7.75; 5 -4,-7.75; 6 -3.5,-7.75; 7 -3,-7.75; 8 -2.5,-7.75; 9 -2,-7.75; 10 -1.5,-7.75; 11 -1,-7.75; 12 -0.5,-7.75; 13 0,-7.75; 14 0.5,-7.75; 15 1,-7.75; 16 1.5,-7.75; 17 2,-7.75; 18 2.5,-7.75; 19 3,-7.75; 20 3.5,-7.75; 21 4,-7.75; 22 4.5,-7.75; 23 5,-7.75; 24 5.5,-7.75; 25 6,-7.75; 51 6,7.75; 52 5.5,7.75; 53 5,7.75; 54 4.5,7.75; 55 4,7.75; 56 3.5,7.75; 57 3,7.75; 58 2.5,7.75; 59 2,7.75; 60 1.5,7.75; 61 1,7.75; 62 0.5,7.75; 63 0,7.75; 64 -0.5,7.75; 65 -1,7.75; 66 -1.5,7.75; 67 -2,7.75; 68 -2.5,7.75; 69 -3,7.75; 70 -3.5,7.75; 71 -4,7.75; 72 -4.5,7.75; 73 -5,7.75; 74 -5.5,7.75; 75 -6,7.75 | smd 1.5 x 0.27: 26 7.75,-6; 27 7.75,-5.5; 28 7.75,-5; 29 7.75,-4.5; 30 7.75,-4; 31 7.75,-3.5; 32 7.75,-3; 33 7.75,-2.5; 34 7.75,-2; 35 7.75,-1.5; 36 7.75,-1; 37 7.75,-0.5; 38 7.75,0; 39 7.75,0.5; 40 7.75,1; 41 7.75,1.5; 42 7.75,2; 43 7.75,2.5; 44 7.75,3; 45 7.75,3.5; 46 7.75,4; 47 7.75,4.5; 48 7.75,5; 49 7.75,5.5; 50 7.75,6; 76 -7.75,6; 77 -7.75,5.5; 78 -7.75,5; 79 -7.75,4.5; 80 -7.75,4; 81 -7.75,3.5; 82 -7.75,3; 83 -7.75,2.5; 84 -7.75,2; 85 -7.75,1.5; 86 -7.75,1; 87 -7.75,0.5; 88 -7.75,0; 89 -7.75,-0.5; 90 -7.75,-1; 91 -7.75,-1.5; 92 -7.75,-2; 93 -7.75,-2.5; 94 -7.75,-3; 95 -7.75,-3.5; 96 -7.75,-4; 97 -7.75,-4.5; 98 -7.75,-5; 99 -7.75,-5.5; 100 -7.75,-6 | drill 0.4: P$1 -4,4; P$2 -2,4; P$3 0,4; P$4 2,4; P$5 4,4; P$6 4,2; P$7 4,0; P$8 4,-2; P$9 4,-4; P$10 2,-4; P$11 0,-4; P$12 -2,-4; P$13 -4,-4; P$14 -4,-2; P$15 -4,0; P$16 -4,2 | smd 12 x 12: THERMAL 0,0
SOT23-5 = smd 0.55 x 1.2: 1 -0.95,-1.3; 2 0,-1.3; 3 0.95,-1.3; 4 0.95,1.3; 5 -0.95,1.3
SOT223-R = smd 1.3 x 1.3: 1 -2.3,-3.05; 2 0,-3.05; 3 2.3,-3.05 | smd 3.6 x 1.3: 4 0,3.05
MOUNTINGHOLE_3.0_PLATED = drill 3 pad 6.452: P$1 0,0
HDMI_MOLEX_47151-0001_DIMLAYER = smd 0.25 x 2.6: 1 4.5,0; 2 4,0; 3 3.5,0; 4 3,0; 5 2.5,0; 6 2,0; 7 1.5,0; 8 1,0; 9 0.5,0; 10 0,0; 11 -0.5,0; 12 -1,0; 13 -1.5,0; 14 -2,0; 15 -2.5,0; 16 -3,0; 17 -3.5,0; 18 -4,0; 19 -4.5,0 | drill 0.9 pad 1.65 long: P$1 -7.25,-0.76; P$2 7.25,-0.76 | drill 0.9 pad 1.5 long: P$3 7.25,-6.72; P$4 -7.25,-6.72
4UCONN_20329 = smd 1 x 2: BASE@1 -0.75,-2; BASE@2 0.75,-2 | smd 0.4 x 1.35: D+ 0,0.775; D- -0.65,0.775; GND 1.3,0.775; ID 0.65,0.775; VBUS -1.3,0.775 | drill 0.7 offset: SPRT@1 -3.3,0.9; SPRT@2 3.3,0.9 | drill 0.6 pad 2.5 square: SPRT@3 -3.6,-1.9; SPRT@4 3.6,-1.9 | hole 0.7: -1.95,0; 1.95,0
RESONATOR-SMD = smd 0.7 x 1.7: 1 -1.2,0; 2 0,0; 3 1.2,0

### Placement (x,y rotation side)
BACKLITEPWM  1.6,81.3 0 top
C1  48.64,28.82 0 top
C2  26.3,47 270 top
C3  27.05,68.8 180 top
C4  43.56,28.82 0 top
C5  41.2,53.87 0 top
C6  40.8,62 90 top
C7  31.75,68.8 180 top
C8  20.25,67.25 0 top
C9  10.51,40.77 270 top
C10  20,46.75 270 top
C11  14.5,54.25 270 top
C12  8.61,40.77 270 top
C13  13.9,34.3 90 top
C14  22.9,34.3 90 top
C15  41.2,50.4 180 top
C16  37.65,72.2 270 top
C17  54,69.5 90 top
C18  51.8,69.5 90 top
C19  45,74.1 270 top
C20  24.3,69.9 270 top
C21  57.31,35.73 180 top
C22  57.31,31.92 0 top
C23  34.98,26.47 270 top
C24  9.02,45.34 180 top
C25  11.68,34.42 90 top
D1  47.3,67.2 180 top
D2  48.8,72.1 90 top
D3  53.72,75.69 180 top
FB1  15.88,42.55 90 top
FB2  41.2,52.07 180 top
FB3  12.54,42.55 90 top
FB4  14.21,42.55 90 top
FB5  57.31,37.64 0 top
FB6  57.31,33.83 0 top
FB7  48.64,26.84 180 top
FB8  37.97,33.49 0 top
FID1  36.3,69.2 0 top
FID2  37.98,40.45 0 top
FID3  163.03,10.15 0 top
FID4  9.4,79.75 0 top
FID5  7.11,13.54 0 top
FID6  163.02,106.44 0 top
GND  1.6,72.9 0 top
IC1  46.1,33.37 90 top
J1  165.1,8 0 bottom
JP3  1.6,70.1 0 top
JP4  1.6,75.7 0 top
JP5  1.6,78.5 0 top
JP6  1.7,45.2 0 top
JP7  1.7,48 0 top
L1  41.5,68.4 0 top
LED1  1.25,14.54 0 top
LED2  1.35,29.5 180 top
LED3  1.25,22.02 180 top
Q1  7.52,20.9 90 top
R1  17.7,69.9 270 top
R2  19.92,42.41 270 top
R3  19.9,69.9 270 top
R4  22.1,69.9 270 top
R5  21.62,42.42 90 top
R6  46.95,55.1 270 top
R7  46.95,59.2 270 top
R8  35.4,45.05 180 top
R9  39.5,45.05 180 top
R10  27.2,42.3 180 top
R11  31.3,42.3 180 top
R12  46.95,63.3 270 top
R13  45.44,37.81 180 top
R14  1.35,18.28 90 top
R15  38.23,77.6 180 top
R16  44.95,77.73 90 top
R17  38.2,81.1 180 top
R18  35.3,74.1 90 top
R19  1.35,25.7 270 top
R20  3.93,20.9 0 top
R21  11.21,19.97 180 top
R22  38.2,84.6 180 top
SJ1  17.84,42.47 90 top
SJ2  23.5,42.5 90 top
SJ3  41.91,77.6 0 top
SJ4  37.85,27.3 0 top
SJ5  41.9,81.1 0 top
SJ6  42,84.6 0 top
U1  29,59 0 top
U2  23.5,74.5 270 top
U3  18.4,32.2 180 top
U4  41.4,74.5 90 top
U$31  4,112.2 0 top
U$32  161.1,112.2 0 top
U$33  161.1,4 0 top
U$34  4,4 0 top
U$75  [ADAFRUIT_TEXT_30MM]  69.6,30.61 0 top
U$76  [PCBFEAT-REV-056]  101.1,21.2 0 top
X1  9.25,59 270 top
X2  3.75,37.6 270 top
Y1  52.19,30.41 90 top

### Tracks (layer width: path | path; a pad name or v marks a point on that pad's centre or on a via)
5.0V  (via drill 0.4)
  Top 0.25: X1.18 7.5,63 v6.9,63.6
  Top 0.406: v17.5,67.4 17.5,68.88 R1.2 R3.2 R4.2 22.18,68.88 24.22,70.92 C20.1 24.8,71.42 U2.4 | v3.6,70.1 JP3.1
  Bottom 0.406: v6.9,63.6 5.5,63.6 5,64.1 5,70.1 | v17.5,67.4 18.8,68.7 18.8,70.4 17.1,72.1 7,72.1 5,70.1 | 5,70.1 v3.6,70.1
24V  (via drill 0.4)
  Top 0.254: 129.9,69.07 129.9,69.37 v130.2,69.67 | 129.9,69.07 130.2,69.37 | 129.9,69.07 129.9,66.9 129.87,66.9 J1.2
  Top 0.406: C17.1 54,68.3 v52.9,67.2 51.8,67.2 | 51.45,68.1 51.8,68.45 C18.1 51.8,67.2 | D2.C 48.8,67.55 D1.C 51.8,67.2
  Bottom 0.406: v130.2,69.67 130.2,70.09 126.66,73.63 63.6,73.6 57.2,67.2 v52.9,67.2
ACTIVE  (via drill 0.4)
  Top 0.254: U1.8 26.5,49.65 v26.65,49.65 | 115.4,66.9 115.4,66.77 | 115.4,66.77 v115.4,65.37 | v25.8,33.9 25.8,23.67 19.9,19.97 R21.1 | 115.37,66.9 115.37,66.8 | 115.37,66.8 115.4,66.77 | 115.37,66.8 J1.31
  Top 0.406: D3.C v56.46,75.69 v56.46,75.7
  Bottom 0.254: 43.9,54.9 44.8,54.9 45.86,53.86 48.54,51.18 88.38,51.18 101.2,64 114.84,63.98 115.4,64.53 v115.4,65.37 | 43.9,54.9 43,54.9 39.4,51.3 28.3,51.3 v26.65,49.65 26.65,44.05 23.8,41.2 23.8,35.9 v25.8,33.9 | 43.9,54.9 43.9,61.3 55,72.4 55,74.36 v56.46,75.7
AGND  (via drill 0.4)
  Top 0.254: R14.2 4.59,19.23 6.81,17.02 30.63,17.03 39.9,24.1 39.9,25.2 | 61.6,39 61.5,38.9 42.9,38.9 40.51,36.51 v40.51,34.45
  other vias: 46.16,29.82 51.5,36.7 50.95,28.09 57.31,30.61 53.71,30.41 40.71,29.95
  pour Top (isolate 0.254): 61.92,39.08 42.58,39.08 38.23,34.73 38.23,25 61.92,25
  pour Bottom (isolate 0.254): 61.92,37.8 49.02,37.8 46.35,35.13 38.23,35.13 38.23,25 61.92,25
ASD
  Top 0.254: U1.46 39,63 40,64 42.4,64 43.5,62.9 R12.3
AVDD  (via drill 0.4)
  Top 0.25: U1.88 18.75,59 18.4,58.65 16.5,58.65 | 16.5,58.65 14.5,56.65 C11.1 | 16.5,58.65 16.5,61.4 16.7,61.6 18.35,61.6 | U1.82 18.75,62 18.35,61.6 | U1.84 18.9,61 18.35,61.55 18.35,61.6 | U1.95 19.3,55.5 18.8,55 18.8,47.6 17.75,46.55 v13.17,46.55 | 13.2,54.3 12.9,54 v12.9,51.75
  Top 0.254: C9.1 FB3.2 12.45,43.57 13.46,44.58 13.46,46.26 v13.17,46.55 | 13.2,54.3 13.7,54.8 14.5,54.8 C11.1
  Bottom 0.25: v13.17,46.55 13.1,46.55 12.9,46.75 v12.9,51.75
AVDD2
  Top 0.406: 47.62,27.08 FB7.2
  Top 0.61: SJ4.2 38.61,26.84 FB7.2
B0
  Top 0.254: U1.10 27.5,45.2 25.9,43.6 R10.4
B1
  Top 0.254: U1.11 28,44.8 26.8,43.6 R10.3
B2
  Top 0.254: U1.12 28.5,44.4 27.6,43.5 R10.2
B3
  Top 0.254: U1.13 29,44 28.5,43.5 R10.1
B4
  Top 0.254: U1.14 29.5,44.1 30,43.6 R11.4
B5
  Top 0.254: U1.15 30,45 30.9,44.1 R11.3
B6
  Top 0.254: U1.16 30.5,45.8 31.7,44.6 R11.2
B7
  Top 0.254: U1.17 31,46.7 32.6,45.1 R11.1
CVB
  Top 0.254: U1.47 38.7,63.5 39.8,64.6 42.7,64.6 43.6,63.7 R12.2
D+
  Top 0.254: IC1.19 36.56,31.09 33.16,34.49 20.19,37.59 20.19,37.6 X2.D+
D-
  Top 0.254: IC1.18 36.8,31.74 33.54,35 20.19,38.23 X2.D-
DISPEN  (via drill 0.4)
  Top 0.254: v112.06,70.33 112.41,70.33 113.31,69.43 113.57,69.18 113.9,68.85 113.9,66.9 113.87,66.9 J1.34 | v73.15,62.9 R12.6
  Bottom 0.254: v73.15,62.9 73.15,60.32 74.17,59.3 79.25,59.3 90.78,70.83 111.56,70.83 v112.06,70.33
G0
  Top 0.254: U1.20 32.5,49.05 34.1,47.45 R8.4
G1
  Top 0.254: U1.21 33,49.35 35,47.35 R8.3
G2
  Top 0.254: U1.22 33.5,49.65 35.8,47.35 R8.2
G3
  Top 0.254: U1.23 34,49.95 36.7,47.25 R8.1
G4
  Top 0.254: U1.24 34.5,50.25 38.2,46.55 R9.4
G5
  Top 0.254: U1.25 35,50.8 39.1,46.7 R9.3
G6
  Top 0.254: U1.26 36.75,50.15 39.9,47 R9.2
G7
  Top 0.254: U1.27 37.7,53.5 37.9,53.3 37.9,49.95 40.8,47.05 R9.1
GND  (via drill 0.4)
  Top 0.25: 42.25,53.98 C5.2 | U1.28 38.2,54 38.8,53.4 v38.8,52.25 | v6.15,62.5 X1.17 10.75,62.5 11,62.25 11,59.5 | U1.98 24,54 | 24,54 24.62,54.62 | U1.92 U1.P$14 | U1.87 24.5,59.5 U1.P$15 | U1.89 24.5,58.5 U1.P$15 | U1.83 24.5,61.5 U1.P$16 | U1.P$1 24.5,63.5 U1.79 19.25,63.5 | U1.76 21.25,67.23 C8.2 | U1.58 31.5,67.75 | U1.1 23,53 24,54 | 24.62,54.62 U1.P$13 | U1.5 25,54.25 24.62,54.62 | U1.P$15 U1.THERMAL | X1.5 7.5,56.5 7.25,56.25 7.25,55 | 7.25,55 7.25,54.1 v7.5,53.85 | X1.2 7.25,55 | X1.8 10.75,58 11,58.25 11,59.5 | 11,59.5 X1.11 | U1.19 32,48.95
  Top 0.254: U1.4 24.5,54.5 U1.P$13 | 32,48.95 32,48.35 v32.3,48.05 | U1.39 37.95,59.5 v38.25,60.65 | U1.45 39.48,62.5 40,63.02 C6.2 | 33.3,43.65 33.3,42.4 | v22.6,49.8 23,50.2 U1.1 | U1.5 25,49.6 | 31.5,67.75 31.5,68.03 C7.2 | U1.68 26.5,68.33 C3.2 | 2.5,51.75 2.5,52.8 | C16.1 37.65,74.35 37.5,74.5 36.6,74.5 | 46.5,44.05 50.6,39.95 75.7,39.95 | 76.85,61.1 75.65,61.1 75.55,61.2 75.35,61.2 | 129.4,69.49 v129.16,69.73 | 116.4,66.87 116.4,70.49 v116.11,70.78 | 112.9,68.17 112.9,68.89 112.56,69.23 111.96,69.23 111.16,70.03 v111.01,70.03 | 103.18,66.18 107.38,70.38 | X2.GND 4.65,36.18 X2.SPRT@2 | 112.56,68.55 112.9,68.55 112.9,65.66 v113.28,65.41 112.87,65.69 J1.36 112.87,66.9 | 129.4,67.71 129.4,65.72 v129.66,65.46 | 129.4,67.71 129.07,68.04 129.07,69.57 | 129.4,67.71 129.37,67.71 J1.3 | 116.37,66.9 116.4,66.87 | J1.29 116.4,66.7 116.4,66.87
  Top 0.305: X1.P$2 8.49,52.86
  Top 0.4: 30.08,71.02 30.1,71 | C15.2 v38.8,50.4 | C5.2 v43.75,54 | C11.2 v14.5,51.75 | C10.2 19.29,45.73 v18.52,45 | 8.49,52.86 v7.5,53.85 | 8.49,64.61 v8.5,64.6
  Top 0.406: X1.P$1 8.49,64.61 | 2.55,67.45 2.55,65.05 | 0.75,66.25 4.3,66.25 | 2.5,52.85 2.5,52.8 | 0.75,51.75 2.5,51.75 | 8.5,52.95 X1.P$2 10.6,51.75
  Bottom 0.4: 30.1,71 30.35,71 | v43.75,54 43.5,54 | v14.5,51.75 14.5,51.5 | v8.5,64.6 8.5,64.4 8.4,64.3
  Bottom 0.406: 2.55,67.35 2.55,65.15 | 4.25,66.25 0.75,66.25 | 8.5,67.5 8.5,65.15 | 6.5,66.25 10.55,66.25 | 0.75,51.75 4.35,51.75 | 8.5,52.95 8.5,50.55 | 6.25,51.75 10.55,51.75
  other vias: 21.15,65.85 42.2,62.9 9.45,46.65 20.7,33.8 25.02,44.7 41.4,74.5 20.9,74.5 19.05,64.2 29.45,68.35 17.2,39.25 12.1,39.69 24.98,39.21 12.38,36.65 19.25,75.95 10.65,75.35 34,71.6 35.8,76.6 19.68,36.57 45,65.6 38.4,65.5 26.87,30.73 27,34.8 34.55,36.4 17.14,32.91 35.65,34.4 36.75,30.1 40.25,59.5 3.23,24.86 3.5,72.9 24.67,30.73 24.67,32.93 26.87,32.93 24.77,28.03 26.77,28.03 26.77,26.23 24.77,26.23 28.76,37.79 13.97,30.33 13.97,27.93 19.17,18.53 19.17,21.33 19.17,15.41 33.8,75.9 36.85,74.5 33.67,74.12 19.48,39.25 22.78,40.27 7.15,39.95
  pour Bottom (rank 3): 165.1,8 0,8 0,108.2 165.1,108.2
  pour Top (isolate 0.35, rank 2): 165.1,8 0,8 0,108.2 165.1,108.2
HSYNC  (via drill 0.4)
  Top 0.254: v113.56,70.33 114.9,68.99 114.9,66.9 114.87,66.9 J1.32 | v74.95,64.6 R12.8
  Bottom 0.254: v74.95,64.6 74.95,61.2 75.65,60.5 77.85,60.5 89.45,72.1 113.06,72.03 113.56,71.53 v113.56,70.33
LEDK  (via drill 0.4)
  Top 0.254: 130.4,68.43 130.4,68.63 131.16,68.63 131.26,68.73 v131.56,68.73 | 130.4,68.43 131.16,68.43 | 130.4,68.43 130.4,66.9 130.37,66.9 J1.1
  Top 0.406: 45.08,75.2 C19.1 | 44.67,75.45 C19.1 | C19.1 48.13,75.12 D2.A 49.95,73.3 55.39,73.3 56.3,72.39 v56.3,68.1 | 131.21,68.53 131.36,68.53 v131.56,68.73 | SJ3.2 42.7,77.6 | SJ6.2 42.66,84.5 SJ5.2 SJ3.2 | SJ3.2 42.7,77.57 U4.3 44.67,75.45 | 44.67,75.45 44.95,75.74 R16.1
  Top 0.61: 44.95,75.1 C19.1
  Bottom 0.406: v56.3,68.1 62.6,74.4 127.26,74.43 131.56,70.13 v131.56,68.73
N$1
  Top 0.25: X1.10 7.75,59 7.25,59.5 5.5,59.5 5,59 5,48.5 5.25,48.25 16.75,48.25 17.5,49 17.5,55.75 18.25,56.5 U1.93
N$2
  Top 0.25: X1.12 5.25,60 4.5,59.25 4.5,48.25 5,47.75 17,47.75 18,48.75 18,55.5 18.5,56 U1.94
N$3
  Top 0.25: U1.90 17.75,58 16,56.25 16,50.25 15.75,50 7,50 6.5,50.5 6.5,57.5 7,58 7.25,58 7.75,57.5 X1.7
N$4
  Top 0.25: X1.9 6.75,58.5 6,57.75 6,50.25 6.75,49.5 16,49.5 16.5,50 16.5,56 18,57.5 U1.91
N$5  (via drill 0.4)
  Top 0.25: X1.4 11,56 12,57 12,68.25 12.25,68.5 12.75,68.5 13,68.25 v13,60.75 | U1.85 17.75,60.5 v17.5,60.75
  Bottom 0.25: v17.5,60.75 v13,60.75
N$6  (via drill 0.4)
  Top 0.25: X1.6 11,57 11.5,57.5 11.5,68.5 12,69 13,69 13.5,68.5 13.5,61.85 13.85,61.5 13.85,60.35 v13,59.5 | U1.86 17.95,60 17.5,59.55 v17.5,59.5
  Bottom 0.25: v17.5,59.5 16.75,60.25 13.75,60.25 v13,59.5
N$7  (via drill 0.4)
  Top 0.25: X1.1 11.75,54.5 13.5,56.25 13.5,57.5 15,59 15,69.75 15.25,70 15.75,70 16,69.75 v16,63.75 | U1.80 18.14,63 18,63.14 v18,63.7
  Bottom 0.254: v16,63.75 16.35,63.4 17.7,63.4 v18,63.7
N$8  (via drill 0.4)
  Top 0.25: X1.3 12,55.5 13,56.5 13,57.75 14.5,59.25 14.5,70 15,70.5 16,70.5 16.5,70 16.5,64.7 17,64.2 17,63.5 v16,62.5 | v17.5,62.5 U1.81
  Bottom 0.254: v16,62.5 16.3,62.8 17.2,62.8 v17.5,62.5
N$9
  Top 0.25: X1.19 10.5,63.5 10.75,63.75 10.75,66.47
  Top 0.254: 10.75,66.47 10.75,70.7 11.75,71.7 16.9,71.7 17.68,70.92 R1.1
N$10
  Top 0.254: IC1.2 50.68,31.09 50.87,30.9 50.87,29.35 51.02,29.21 Y1.1
N$11
  Top 0.203: 52.09,31.74 Y1.3
  Top 0.254: IC1.3 52.09,31.74
N$12
  Top 0.254: IC1.17 43.49,32.39 43.66,32.22 43.66,29.94 C4.1
N$13
  Top 0.254: R19.1 LED2.C
N$14
  Top 0.254: R6.5 75.55,53.8 101.28,79.53 124.51,79.53 130.06,73.98 130.06,73.33 128.4,71.67 128.4,66.9 128.37,66.9 J1.5
N$15  (via drill 0.4)
  Top 0.254: v130.36,74.78 130.16,74.58 124.71,80.03 101.08,80.03 75.75,54.7 R6.6 | v129.26,73.68 127.9,72.32 127.9,66.9 127.87,66.9 J1.6
  Bottom 0.254: v130.36,74.78 v129.26,73.68
N$16  (via drill 0.4)
  Top 0.254: v129.91,75.93 129.71,75.73 124.91,80.53 100.88,80.53 75.85,55.5 R6.7 | v128.46,74.48 127.4,73.42 127.4,66.9 127.37,66.9 J1.7
  Bottom 0.254: v129.91,75.93 v128.46,74.48
N$17  (via drill 0.4)
  Top 0.254: v129.41,77.13 129.21,76.93 125.11,81.03 100.68,81.03 76.05,56.4 R6.8 | v127.61,75.33 126.9,74.62 126.9,66.9 126.87,66.9 J1.8
  Bottom 0.254: v129.41,77.13 v127.61,75.33
N$18  (via drill 0.4)
  Top 0.254: 128.71,78.13 v128.91,78.33 | v126.76,76.18 126.4,75.82 126.4,66.9 126.37,66.9 J1.9 | R7.5 76.85,57.9 100.55,81.6 125.25,81.6 128.52,78.33 v128.91,78.33 | 129.18,78.33 v128.91,78.33
  Bottom 0.254: v128.91,78.33 v126.76,76.18
N$19  (via drill 0.4)
  Top 0.254: 128.21,79.33 v128.41,79.53 | v125.91,77.03 125.9,77.02 125.9,66.9 125.87,66.9 J1.10 | R7.6 77.05,58.8 100.35,82.1 125.45,82.1 128.02,79.53 v128.41,79.53 | 128.48,79.53 v128.41,79.53
  Bottom 0.254: v128.41,79.53 v125.91,77.03
N$20  (via drill 0.4)
  Top 0.254: 127.71,80.53 v127.91,80.73 127.91,81.04 126.25,82.7 100.25,82.7 77.15,59.6 R7.7 | v125.06,77.88 125.06,76.13 125.4,75.79 125.4,66.9 125.37,66.9 J1.11
  Bottom 0.254: v127.91,80.73 v125.06,77.88
N$21  (via drill 0.4)
  Top 0.254: 124.9,68.17 124.91,68.17 | 124.9,68.17 124.9,75.64 124.21,76.33 v124.21,78.73 | R7.8 77.35,60.5 100.65,83.8 v122.35,83.8 | 124.9,68.17 124.9,66.9 124.87,66.9 J1.12
  Bottom 0.254: v122.35,83.8 124.21,81.94 v124.21,78.73
N$22  (via drill 0.4)
  Top 0.254: R8.5 v34.1,43 | v44.75,52.7 75.15,52.7 101.48,79.03 120.85,79.03 124.4,75.48 124.4,66.9 124.37,66.9 J1.13
  Bottom 0.254: v34.1,43 34.1,43.5 43.3,52.7 v44.75,52.7
N$23  (via drill 0.4)
  Top 0.254: R8.6 34.95,44.2 v34.95,42.2 | v45.75,51.9 75.15,51.9 101.78,78.53 120.55,78.53 123.9,75.18 123.9,66.9 123.87,66.9 J1.14
  Bottom 0.254: v34.95,42.2 34.95,43.3 43.55,51.9 v45.75,51.9
N$24  (via drill 0.4)
  Top 0.254: R8.7 v35.8,43 | v46.65,51.1 75.15,51.1 102.08,78.03 120.25,78.03 123.4,74.88 123.4,66.9 123.37,66.9 J1.15
  Bottom 0.254: v46.65,51.1 43.9,51.1 v35.8,43
N$25  (via drill 0.4)
  Top 0.254: R8.8 36.7,43.9 36.9,43.7 v36.9,42.15 | v47.55,50.3 75.15,50.3 102.38,77.53 120,77.53 122.9,74.63 122.9,66.9 122.87,66.9 J1.16
  Bottom 0.254: v36.9,42.15 36.9,42.95 44.25,50.3 v47.55,50.3
N$26  (via drill 0.4)
  Top 0.254: R9.5 v38.2,43 | v48.45,49.5 75.15,49.5 102.68,77.03 119.75,77.03 122.4,74.38 122.4,66.9 122.37,66.9 J1.17
  Bottom 0.254: v38.2,43 38.2,43.35 44.35,49.5 v48.45,49.5
N$27  (via drill 0.4)
  Top 0.254: R9.6 39.05,44.15 v39.05,42.15 | v49.35,48.7 75.15,48.7 102.98,76.53 119.5,76.53 121.9,74.13 121.9,66.9 121.87,66.9 J1.18
  Bottom 0.254: v39.05,42.15 39.05,43.35 44.4,48.7 v49.35,48.7
N$28  (via drill 0.4)
  Top 0.254: R9.7 v39.9,43 | v50.25,47.9 75.15,47.9 103.28,76.03 119.2,76.03 121.4,73.83 121.4,66.9 121.37,66.9 J1.19
  Bottom 0.254: v39.9,43 39.9,43.2 44.6,47.9 v50.25,47.9
N$29  (via drill 0.4)
  Top 0.254: R9.8 40.8,42.15 v40.75,42.15 | v51.15,47.1 75.15,47.1 103.58,75.53 118.95,75.53 120.9,73.58 120.9,66.9 120.87,66.9 J1.20
  Bottom 0.254: v51.15,47.1 44.7,47.1 40.75,43.15 v40.75,42.15
N$30  (via drill 0.4)
  Top 0.254: R10.5 v25.9,40.2 | v45.35,46.3 75.15,46.3 103.88,75.03 118.7,75.03 120.4,73.33 120.4,66.9 120.37,66.9 J1.21
  Bottom 0.254: v45.35,46.3 41.7,42.65 41.7,41.9 41.15,41.35 28.95,41.35 28.5,41.8 26.3,41.8 25.9,41.4 v25.9,40.2
N$31  (via drill 0.4)
  Top 0.254: R10.6 26.75,41.4 v26.75,39.15 | v46.25,45.5 75.15,45.5 104.18,74.53 118.45,74.53 119.9,73.08 119.9,66.9 119.87,66.9 J1.22
  Bottom 0.254: v26.75,39.15 26.75,40.85 27.1,41.2 28.1,41.2 28.45,40.85 41.55,40.85 46.2,45.5 v46.25,45.5
N$32  (via drill 0.4)
  Top 0.254: R10.7 v27.6,40.2 | v47.15,44.7 75.15,44.7 104.48,74.03 118.2,74.03 119.4,72.83 119.4,66.9 119.37,66.9 J1.23
  Bottom 0.254: v27.6,40.2 27.75,40.35 42.3,40.35 46.7,44.7 v47.15,44.7
N$33  (via drill 0.4)
  Top 0.254: R10.8 28.45,41.4 v28.45,39.15 | v48.05,43.9 75.15,43.9 104.78,73.53 117.95,73.53 118.9,72.58 118.9,66.9 118.87,66.9 J1.24
  Bottom 0.254: v28.45,39.15 29.15,39.85 43.4,39.85 47.5,43.9 v48.05,43.9
N$34  (via drill 0.4)
  Top 0.254: R11.5 30,39.2 v29.75,38.95 | v48.95,43.1 75.15,43.1 105.08,73.03 117.7,73.03 118.4,72.33 118.4,66.9 118.37,66.9 J1.25
  Bottom 0.254: v29.75,38.95 30.15,39.35 43.85,39.35 47.6,43.1 v48.95,43.1
N$35  (via drill 0.4)
  Top 0.254: R11.6 30.9,38.7 v31.05,38.45 | 117.9,67.03 117.9,72.03 117.4,72.53 105.38,72.53 75.15,42.3 v49.85,42.3 | 117.9,67.03 117.9,66.9 | 117.87,66.9 J1.26 117.9,67.03
  Bottom 0.254: v31.05,38.45 31.45,38.85 44.35,38.85 47.8,42.3 v49.85,42.3
N$36  (via drill 0.4)
  Top 0.254: R11.7 31.7,39.6 32.35,38.95 v32.35,37.85 | v50.75,41.5 75.15,41.5 105.71,72.03 117.14,72.03 117.4,71.78 117.4,66.9 117.37,66.9 J1.27
  Bottom 0.254: v32.35,37.85 32.85,38.35 44.85,38.35 48,41.5 v50.75,41.5
N$37
  Top 0.254: SJ5.1 R17.1
N$38
  Top 0.25: U1.97 19.75,54.5 19.5,54.25 19.5,48.27 C10.1
  Top 0.254: FB4.2 15.65,45.93 17.94,45.96 C10.1
N$39  (via drill 0.4)
  Top 0.254: R11.8 32.6,39.95 33.65,38.9 v33.65,37.25 | v51.65,40.7 75.15,40.7 105.98,71.53 116.64,71.53 116.9,71.28 116.9,66.9 116.87,66.9 J1.28
  Bottom 0.254: v33.65,37.25 34.25,37.85 45.25,37.85 48.1,40.7 v51.65,40.7
N$40
  Top 0.203: 43.92,37.3 R13.2
  Top 0.254: IC1.11 43.68,36.29 43.92,36.53 43.92,37.3
N$41
  Top 0.254: LED1.C 1.35,15.82 R14.1
N$42  (via drill 0.4)
  Top 0.25: 39.55,61.5 U1.43 35.5,61.5 | 20.25,64 U1.78 22.3,64 22.5,64.2 22.5,65.1 22.9,65.5 32,65.5 | 19.25,67.23 C8.1 | 35.5,61.5 35.5,65.2 35.2,65.5 32,65.5 | U1.57 32,65.5 | 35.5,61.5 35.5,54.5 U1.29 38.8,54.5 39.3,54 C5.1 FB2.2 40.2,52.17
  Top 0.254: v31.9,46.95 31.5,47.35 U1.18 31.5,52.3 31.7,52.5 35.2,52.5 35.5,52.8 35.5,54.5 | 39.55,61.5 40.28,61.5 C6.1 | U1.57 32,68.03 C7.1 | 20.25,64 20,64.25 20,66.48 C8.1
N$43
  Top 0.254: LED1.A 2.3,13.5 2.6,13.79 2.6,15.94 3.1,16.44 31.13,16.4 41.23,24.3 54.2,24.3 54.7,24.8 54.7,32.39 54.05,33.04 IC1.5
N$44
  Top 0.254: R22.1 SJ6.1
N$45
  Top 0.254: R20.1 2.66,20.97 LED3.C
N$46
  Top 0.254: Q1.3 R20.2
N$47
  Top 0.406: D1.A 43.3,67.2 L1.P$2 42.7,69 U4.1
N$48
  Top 0.254: R21.2 9.94,19.95 Q1.1
N$49
  Top 0.406: SJ3.1 R15.1
N$52  (via drill 0.4)
  Top 0.254: v38.65,75.35 35.53,75.35 R18.2 34.8,75.12 34.8,78.9 32.4,81.3 BACKLITEPWM.1
  Top 0.406: U4.4 38.75,75.45 v38.65,75.35 | D3.A 51.2,75.69 v50.95,75.7
  Bottom 0.254: v38.65,75.35 39,75.7 v50.95,75.7
N$53
  Top 0.254: FB5.2 59.84,37.64 60.4,38.2 78.1,38.2 104.03,64.13 104.03,65.4 107.86,69.23 111.19,69.23 111.4,69.03 111.4,66.9 111.37,66.9 J1.39
N$54
  Top 0.254: FB6.2 61.9,37.4 78.2,37.4 104.53,63.73 104.53,65.15 108.11,68.73 110.69,68.73 110.9,68.53 110.9,66.9 110.87,66.9 J1.40
N$55
  Top 0.254: IC1.4 48.7,32.39 48.54,32.23 48.54,30.44 | 48.54,30.44 48.54,29.94 C1.2 | IC1.1 48.54,30.44
  Top 0.305: FB7.1 C1.2
OCK_INV  (via drill 0.4)
  Top 0.25: U1.100 22.25,53 22.5,52.75 22.5,51.25 v21.25,50
  Top 0.254: v22.1,45.7 22.22,45.58 22.22,44.58 21.62,43.97 R5.2 20.72,42.42 19.18,42.42 18.34,41.45 SJ1.1
  Bottom 0.254: v21.25,50 21.25,49.55 22.1,48.7 v22.1,45.7 20.12,45.7 19.5,45.08
PIXCLK  (via drill 0.4)
  Top 0.254: 115.9,66.9 115.9,69.49 v115.06,70.33 | v76.25,62 R12.5 | 115.9,66.9 115.87,66.9 | J1.30 115.9,66.7 115.9,66.9
  Bottom 0.254: v76.25,62 76.25,61.9 87.28,72.93 114.46,72.93 115.06,72.33 v115.06,70.33
R0
  Top 0.254: U1.30 44.1,55 45.3,53.8 R6.4
R1
  Top 0.254: U1.31 44.4,55.5 45.2,54.7 R6.3
R2
  Top 0.254: U1.32 44.7,56 45.2,55.5 R6.2
R3
  Top 0.254: U1.33 45.05,56.5 45.15,56.4 R6.1
R4
  Top 0.254: U1.34 45,57 45.9,57.9 R7.4
R5
  Top 0.254: U1.35 43.7,57.5 45,58.8 R7.3
R6
  Top 0.254: U1.36 42.2,58 43.8,59.6 R7.2
R7
  Top 0.254: U1.37 41.25,58.5 43.25,60.5 R7.1
SCL  (via drill 0.4)
  Top 0.25: X1.15 7.35,61.5 6.75,60.9 5.1,60.9
  Top 0.254: U2.1 20.4,75.45 19.9,74.95 v19.9,72.35 R3.1 | 5.1,60.9 4.55,61.45 4.55,63.8 5.6,64.85 5.6,75.5 v5.4,75.7 JP4.1
  Bottom 0.254: v19.9,72.35 18.75,73.5 7.6,73.5 v5.4,75.7
SDA  (via drill 0.4)
  Top 0.25: X1.16 7,62 6.5,61.5 5.35,61.5
  Top 0.254: U2.3 22.1,73.55 v22.1,72.45 R4.1 | 5.35,61.5 5.15,61.7 5.15,63.1 6.4,64.35 v6.4,78.5 JP5.1
  Bottom 0.254: v22.1,72.45 20.95,73.6 20.5,73.6 15.6,78.5 v6.4,78.5
ST  (via drill 0.4)
  Top 0.254: 23.7,44.02 23.7,44.07 | 23.7,44.07 v23.7,45.7 | U1.3 24,49.4 v23.6,49 | 23.7,44.07 23.63,44 SJ2.2 23.83,43.31 24.26,43.31 24.64,42.93 24.64,40.64 23.49,39.37 21.08,39.37 19.91,40.54 R2.2
  Bottom 0.254: v23.6,49 23.6,45.8 v23.7,45.7
VDD  (via drill 0.4, 0.5)
  Top 0.254: C15.1 FB2.1 | LED3.A 3.26,23.05 5.89,25.67 v5.89,29.15 4.49,30.55 LED2.A | v128.31,64.7 128.31,65.25 128.9,65.84 128.9,66.9 128.87,66.9 J1.4
  Top 0.4: 42.2,52.13 FB2.1
  Top 0.406: C14.1 21.82,32.2 18.4,32.2 | FB1.1 15.88,40.51 16.26,40.13 18.37,40.13 v18.4,40.1
  Top 0.61: C15.1 42.22,47.93 42.9,47.25 42.9,41.87 37.53,36.5 v36.2,36.5 | FB3.1 FB4.1 FB1.1 | v5.89,29.15 U3.4 | v3.7,46.3 3.7,46.6 3.2,47.1 1.7,47.1 JP7.1 | v34.8,29.34 34.98,29.15 C23.1 34.98,27.3 SJ4.1
  Top 0.813: U3.4 18.4,32.2 v18.4,33.75 U3.2
  Bottom 0.254: 18.4,33.7 v18.4,33.75
  Bottom 0.61: v18.4,40.1 v18.4,33.75 | 31.5,31.8 v36.2,36.5 45.87,36.5 48.44,39.07 57.46,39.07 78.9,39.1 102.56,62.76 126.62,62.76 v128.31,64.7 | 31.5,31.8 20.3,31.8 18.4,33.7 | v5.89,29.15 5.89,46.3 v3.7,46.3 | 31.5,31.8 33.96,29.34 v34.8,29.34
VDDIO  (via drill 0.4)
  Top 0.25: U1.99 20.25,53.5 20,53.25 20,49.75 21.25,48.5 21.25,46.9 | U1.6 25.5,50.3 25.8,50 26,50.2 U1.7
  Top 0.254: U1.38 38.5,59 v38.85,59.35 | 25.8,50 25.8,48.02 C2.1 | U1.67 27,67.73 C3.1 | 21.3,47.15 21.25,46.9 21.25,44.85 20.85,44.45 20.32,44.45 19.91,44.04 R2.1 17.96,43.36 SJ1.2 15.97,43.48 FB1.2
  Top 0.406: C2.1 25.48,47.89 v24.75,47.15 21.3,47.15 | C3.1 28.3,68.8 v29.6,70.1
  Bottom 0.406: v29.6,70.1 30.9,68.8 38.35,68.8 39.45,67.7 39.45,59.95 v38.85,59.35 32.5,53 26.5,53 24.75,51.37 v24.75,47.15
VIN  (via drill 0.4, 0.5)
  Top 0.254: 35.3,73.4 R18.1 v35.3,71.6
  Top 0.305: X2.VBUS 5.63,38.9 5.71,38.99
  Top 0.406: v39.7,71.6 L1.P$1 39.7,66.7 v37.7,66.7 | v39.7,71.6 39.7,73.55 U4.5 | 16.1,33.75 15.88,33.53 | 15.88,33.53 15.63,33.28 C13.1 | C16.2 38.07,71.6 v39.7,71.6 | v16,33.4 16,33.53 15.88,33.53 | 5.71,38.99 6.1,39.37 6.1,42.49 v6.91,43.25 6.83,43.25 8.28,41.79
  Top 0.61: v6.91,43.25 6.91,44.65 C24.+ 5.46,45.34 5.21,45.08 1.82,45.08 JP6.1 | C12.1 8.28,41.79 | C25.1 11.8,33.35 C13.1
  Top 0.813: 16.1,33.75 U3.3
  Bottom 0.254: v35.3,71.6 v39.7,71.6
  Bottom 0.406: v37.7,66.7 34.95,63.95 32.55,63.95 32,63.4 32,62 26,56 24.5,56 19.75,51.25 19.75,47.45 16.1,43.8 16.1,43.25 | 16.1,43.25 16.1,33.65 v16,33.4 | v6.91,43.25 16.1,43.25
VSYNC  (via drill 0.4)
  Top 0.254: v114.42,64.86 114.4,65.6 114.4,66.9 114.37,66.9 J1.33 | v74.05,63.7 R12.7
  Bottom 0.254: v74.05,63.7 74.05,60.81 74.96,59.9 78.45,59.9 89.98,71.43 112.11,71.43 112.81,70.73 112.81,69.98 114.42,68.37 v114.42,64.86
X+  (via drill 0.4)
  Top 0.254: IC1.7 51.32,34.34 v51.82,34.84 | v61.24,34.84 77.39,34.84 105.16,62.61 110.81,62.61 112.4,64.2 112.4,66.9 112.37,66.9 J1.37
  Bottom 0.254: v51.82,34.84 v61.24,34.84
X-
  Top 0.203: C21.1 56.36,37.64 FB5.1 56.3,37.13
  Top 0.254: IC1.14 44.7,34.34 45.97,35.61 45.97,37.33 R13.1 56.13,37.81 FB5.1
XCV
  Top 0.254: U1.48 38.4,64 39.6,65.2 43,65.2 43.6,64.6 R12.1
Y+  (via drill 0.4)
  Top 0.254: IC1.15 44.5,33.69 v44.88,33.31 | 111.9,66.7 111.9,64.46 110.55,63.12 104.77,63.12 78.05,36.4 61.6,36.4 60,34.8 v60,33.31 | 111.9,66.7 111.9,66.9 111.87,66.9 | J1.38 111.9,66.7
  Bottom 0.254: v44.88,33.31 v60,33.31
Y-  (via drill 0.4)
  Top 0.254: IC1.16 43.76,33.04 v45.16,31.64 | FB6.1 C22.1 v56.3,30.02
  Bottom 0.254: v45.16,31.64 54.68,31.64 v56.3,30.02
ZXC
  Top 0.254: U1.44 R12.4

### Text on the board
tPlace: -50mA | -50mA | Backlight | -25mA | SDA | SCL | GND | EDID EEPROM | +5V(HDMI) | +3V3 | +5V / USB | INV | ST | PWR-GOOD | 7" 800x480 HDMI Backpack / (+ AR1100 Touch Controller) / PWM-able Backlight | VIDEO-GOOD | TOUCH